# Altium project Project-C_CONTOLLER.PrjPCB
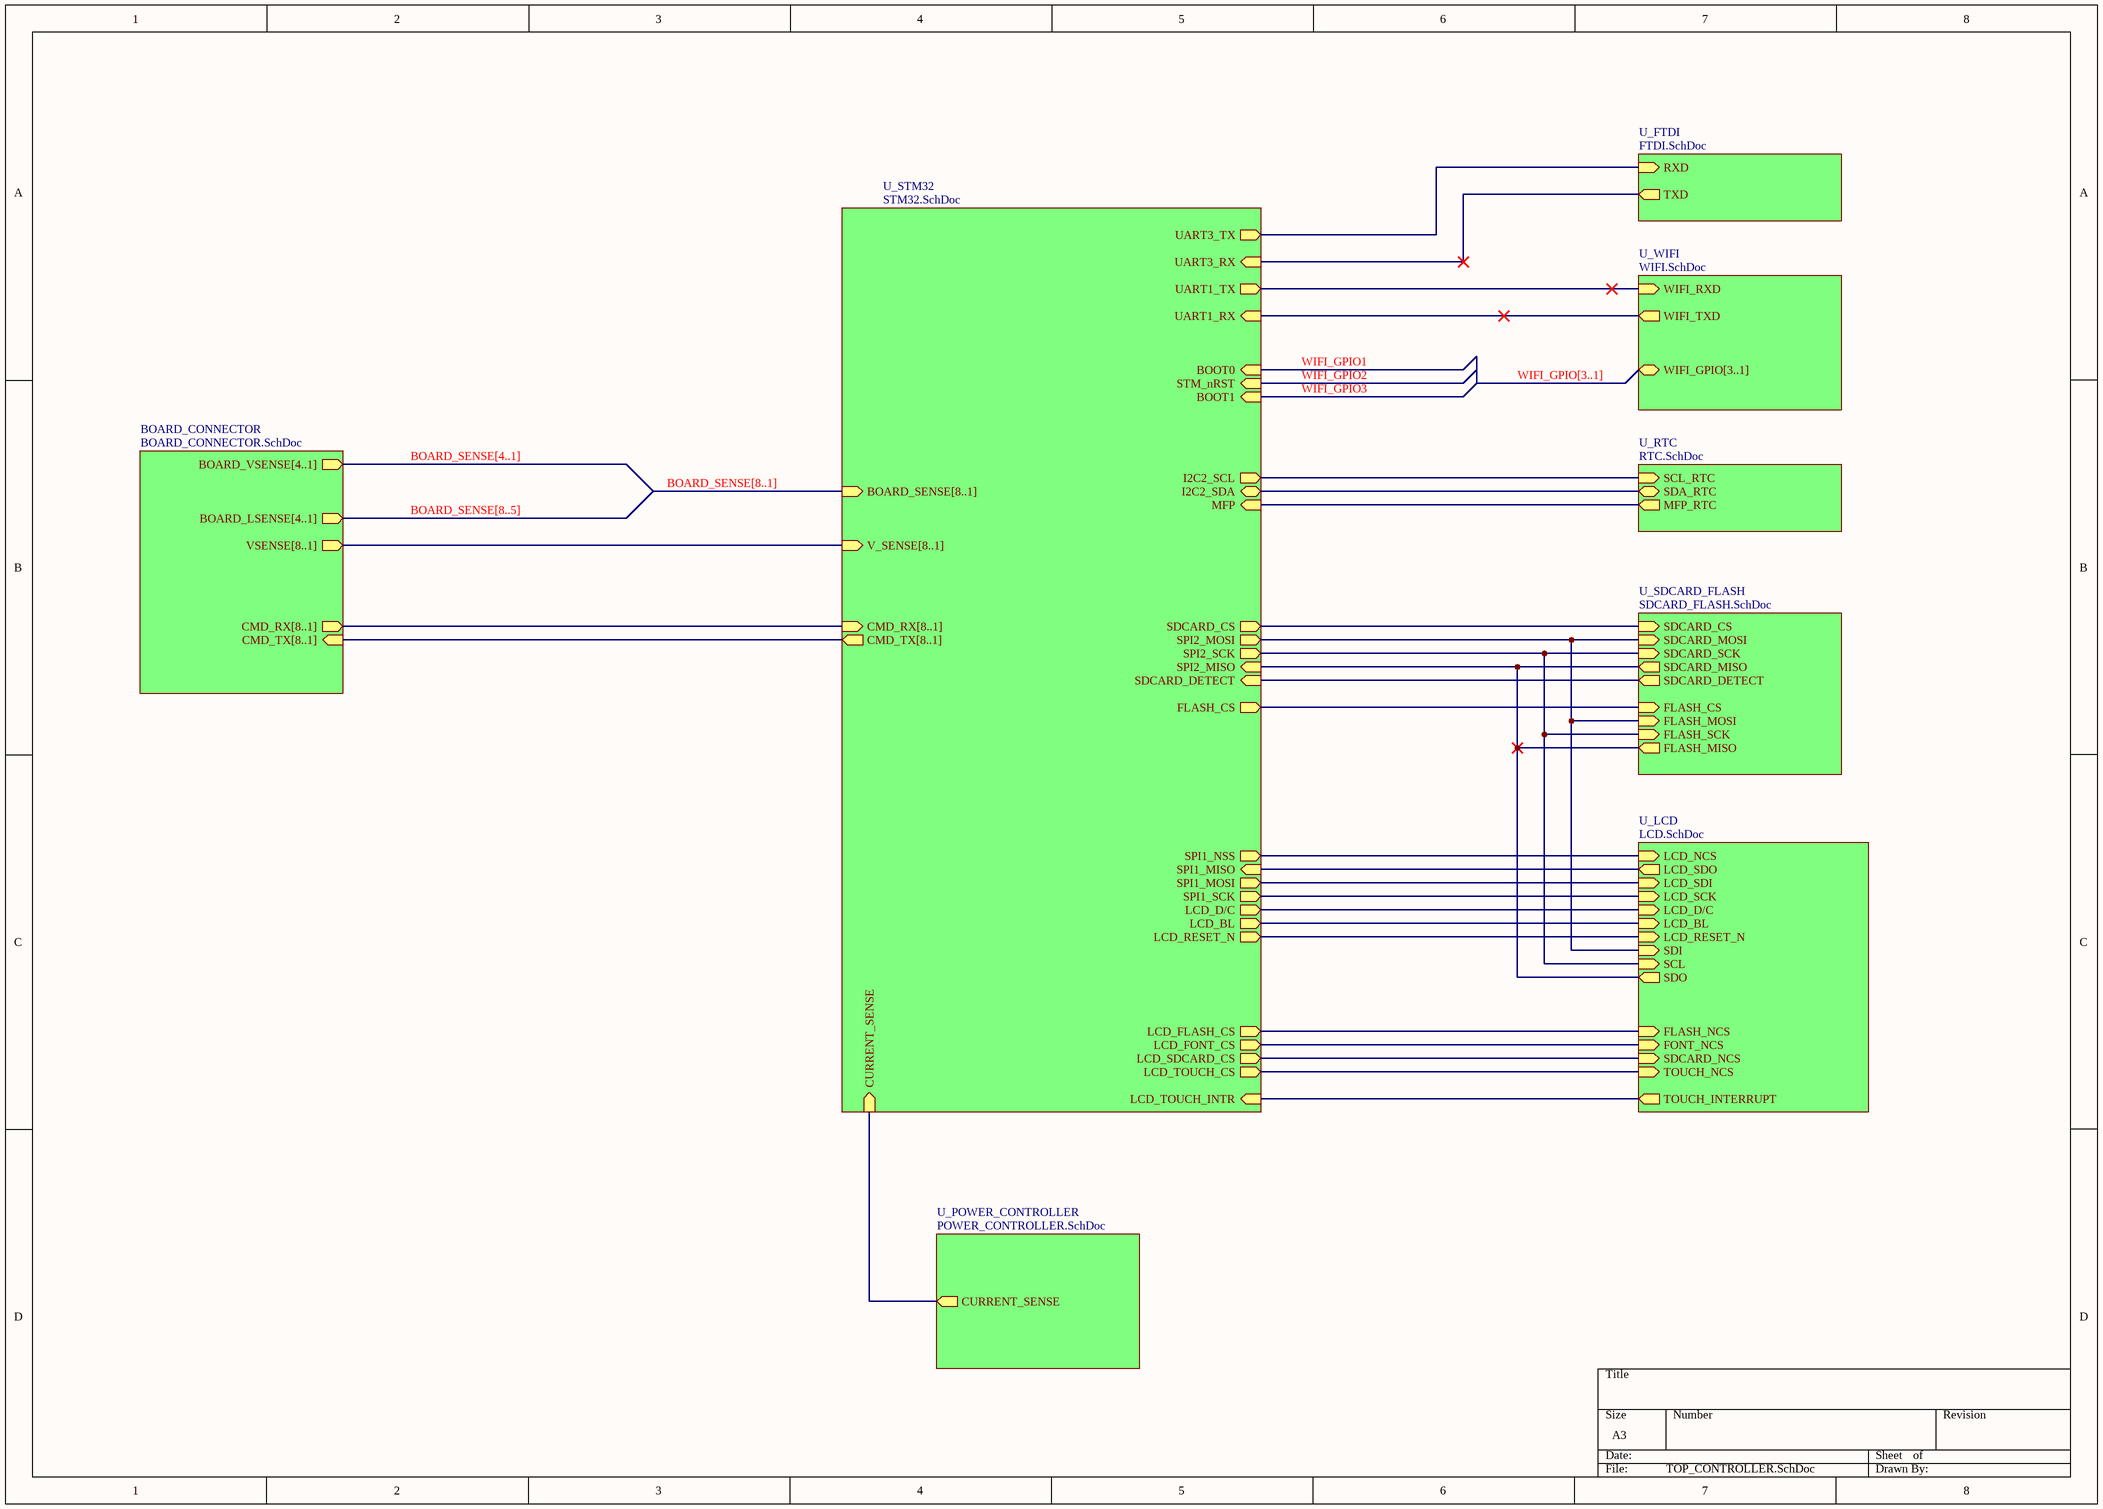
[diagram p0: TOP_CONTROLLER.SchDoc]
10 sheets, 191 parts. Net scope: hierarchical (ports join the sheet entries above them; power ports are global).
Board file: PCB4.PcbDoc
Sheets:
  TOP_CONTROLLER.SchDoc
    U_RTC = RTC.SchDoc
    U_FTDI = FTDI.SchDoc
    U_WIFI = WIFI.SchDoc
    U_STM32 = STM32.SchDoc
    U_SDCARD_FLASH = SDCARD_FLASH.SchDoc
    U_LCD = LCD.SchDoc
    BOARD_CONNECTOR = BOARD_CONNECTOR.SchDoc
      U_BOARD_CONNECTOR_1x_1 = BOARD_CONNECTOR_1x.SchDoc
      U_BOARD_CONNECTOR_1x_2 = BOARD_CONNECTOR_1x.SchDoc
      U_BOARD_CONNECTOR_1x_3 = BOARD_CONNECTOR_1x.SchDoc
      U_BOARD_CONNECTOR_1x_4 = BOARD_CONNECTOR_1x.SchDoc
    U_POWER_CONTROLLER = POWER_CONTROLLER.SchDoc

## Sheet TOP_CONTROLLER.SchDoc
size A3

### Sub-sheets
BOARD_CONNECTOR = BOARD_CONNECTOR.SchDoc: BOARD_VSENSE[4..1] (out), BOARD_LSENSE[4..1] (out), CMD_RX[8..1] (out), CMD_TX[8..1] (in), VSENSE[8..1] (out)
U_FTDI = FTDI.SchDoc: TXD (out), RXD (in)
U_LCD = LCD.SchDoc: TOUCH_INTERRUPT (out), SDO (out), SCL (in), SDI (in), FLASH_NCS (in), FONT_NCS (in), SDCARD_NCS (in), TOUCH_NCS (in), LCD_SCK (in), LCD_SDI (in), LCD_SDO (out), LCD_NCS (in), LCD_D/C (in), LCD_BL (in), LCD_RESET_N (in)
U_POWER_CONTROLLER = POWER_CONTROLLER.SchDoc: CURRENT_SENSE (out)
U_RTC = RTC.SchDoc: SCL_RTC (in), SDA_RTC (bidir), MFP_RTC (out)
U_SDCARD_FLASH = SDCARD_FLASH.SchDoc: SDCARD_CS (in), SDCARD_MOSI (in), SDCARD_SCK (in), SDCARD_MISO (out), FLASH_CS (in), FLASH_MISO (out), FLASH_SCK (in), FLASH_MOSI (in), SDCARD_DETECT (out)
U_STM32 = STM32.SchDoc: SPI1_NSS (out), SPI1_MOSI (out), SPI1_MISO (in), SPI1_SCK (out), SPI2_MOSI (out), SPI2_MISO (in), SPI2_SCK (out), I2C2_SCL (out), I2C2_SDA (bidir), UART1_TX (out), UART1_RX (in), UART3_RX (in), UART3_TX (out), STM_nRST (in), BOOT0 (in), BOOT1 (in), MFP (in), FLASH_CS (out), SDCARD_CS (out), LCD_D/C (out), LCD_TOUCH_INTR (in), LCD_TOUCH_CS (out), LCD_FONT_CS (out), LCD_FLASH_CS (out), LCD_SDCARD_CS (out), LCD_BL (out), LCD_RESET_N (out), CMD_RX[8..1] (in), CMD_TX[8..1] (out), BOARD_SENSE[8..1] (in), V_SENSE[8..1] (in), SDCARD_DETECT (in), CURRENT_SENSE (in)
U_WIFI = WIFI.SchDoc: WIFI_RXD (in), WIFI_TXD (out), WIFI_GPIO[3..1] (bidir)

### Nets
CURRENT_SENSE: sheet U_STM32/CURRENT_SENSE, sheet U_POWER_CONTROLLER/CURRENT_SENSE
FLASH_CS: sheet U_STM32/FLASH_CS, sheet U_SDCARD_FLASH/FLASH_CS
FLASH_MISO: sheet U_STM32/SPI2_MISO, sheet U_SDCARD_FLASH/SDCARD_MISO, sheet U_SDCARD_FLASH/FLASH_MISO, sheet U_LCD/SDO
FLASH_MOSI: sheet U_STM32/SPI2_MOSI, sheet U_SDCARD_FLASH/SDCARD_MOSI, sheet U_SDCARD_FLASH/FLASH_MOSI, sheet U_LCD/SDI
FLASH_NCS: sheet U_STM32/LCD_FLASH_CS, sheet U_LCD/FLASH_NCS
FLASH_SCK: sheet U_STM32/SPI2_SCK, sheet U_SDCARD_FLASH/SDCARD_SCK, sheet U_SDCARD_FLASH/FLASH_SCK, sheet U_LCD/SCL
FONT_NCS: sheet U_STM32/LCD_FONT_CS, sheet U_LCD/FONT_NCS
I2C2_SCL: sheet U_RTC/SCL_RTC, sheet U_STM32/I2C2_SCL
I2C2_SDA: sheet U_RTC/SDA_RTC, sheet U_STM32/I2C2_SDA
LCD_BL: sheet U_STM32/LCD_BL, sheet U_LCD/LCD_BL
LCD_D/C: sheet U_STM32/LCD_D/C, sheet U_LCD/LCD_D/C
LCD_NCS: sheet U_STM32/SPI1_NSS, sheet U_LCD/LCD_NCS
LCD_RESET_N: sheet U_STM32/LCD_RESET_N, sheet U_LCD/LCD_RESET_N
LCD_SCK: sheet U_STM32/SPI1_SCK, sheet U_LCD/LCD_SCK
LCD_SDCARD_CS: sheet U_STM32/LCD_SDCARD_CS, sheet U_LCD/SDCARD_NCS
LCD_SDI: sheet U_STM32/SPI1_MOSI, sheet U_LCD/LCD_SDI
LCD_SDO: sheet U_STM32/SPI1_MISO, sheet U_LCD/LCD_SDO
LCD_TOUCH_CS: sheet U_STM32/LCD_TOUCH_CS, sheet U_LCD/TOUCH_NCS
LCD_TOUCH_INTR: sheet U_STM32/LCD_TOUCH_INTR, sheet U_LCD/TOUCH_INTERRUPT
MFP: sheet U_RTC/MFP_RTC, sheet U_STM32/MFP
RXD: sheet U_FTDI/RXD, sheet U_STM32/UART3_TX
SDCARD_CS: sheet U_STM32/SDCARD_CS, sheet U_SDCARD_FLASH/SDCARD_CS
SDCARD_DETECT: sheet U_STM32/SDCARD_DETECT, sheet U_SDCARD_FLASH/SDCARD_DETECT
TXD: sheet U_FTDI/TXD, sheet U_STM32/UART3_RX
UART1_RX: sheet U_WIFI/WIFI_TXD, sheet U_STM32/UART1_RX
UART1_TX: sheet U_WIFI/WIFI_RXD, sheet U_STM32/UART1_TX

### Buses and harness runs
bus BOARD_SENSE[4..1] = sheet BOARD_CONNECTOR/BOARD_VSENSE[4..1]
bus BOARD_SENSE[8..1] = sheet U_STM32/BOARD_SENSE[8..1]
bus BOARD_SENSE[8..5] = sheet BOARD_CONNECTOR/BOARD_LSENSE[4..1]
bus sheet BOARD_CONNECTOR/CMD_RX[8..1] = sheet U_STM32/CMD_RX[8..1]
bus sheet BOARD_CONNECTOR/CMD_TX[8..1] = sheet U_STM32/CMD_TX[8..1]
bus sheet BOARD_CONNECTOR/VSENSE[8..1] = sheet U_STM32/V_SENSE[8..1]
bus WIFI_GPIO[3..1] = sheet U_WIFI/WIFI_GPIO[3..1]

## Sheet RTC.SchDoc
size B
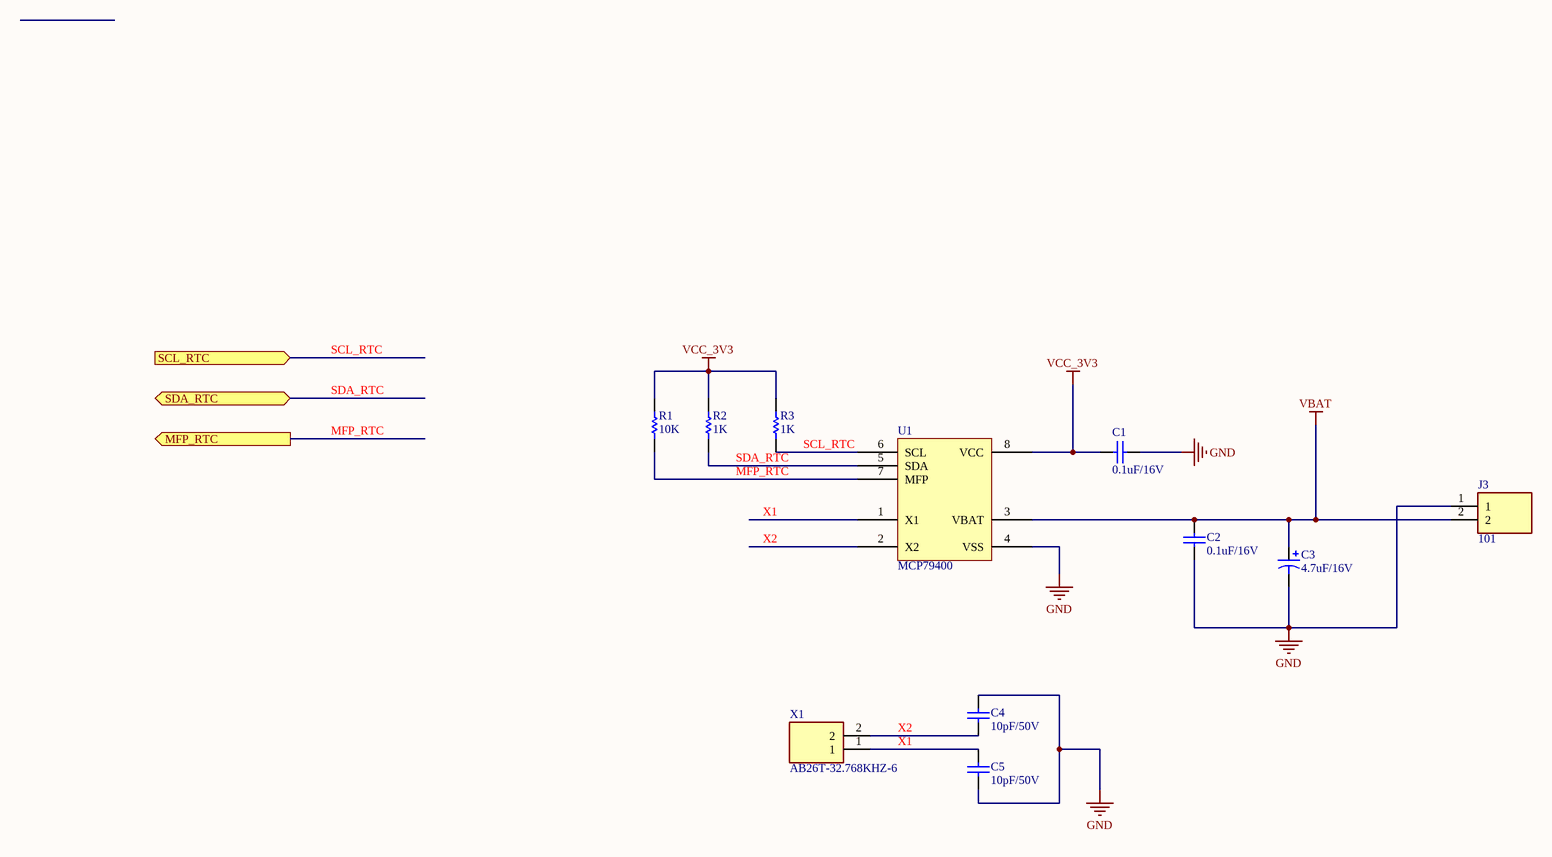
[diagram p1: RTC.SchDoc]

### Parts
C1  0.1uF/16V  [0603C]
C2  0.1uF/16V  [0603C]
C3  4.7uF/16V  [CASE-A]
C4  10pF/50V  [0603C]
C5  10pF/50V  [0603C]
J3  101  [101]
R1  10K  [0603R]
R2  1K  [0603R]
R3  1K  [0603R]
U1  MCP79400  [MCP79400-I/SN]
X1  AB26T-32.768KHZ-6  [AB26T32768KHZE]

### Ports
MFP_RTC (out), SCL_RTC (in), SDA_RTC (bidir)

### Nets
GND: C1.2 C2.2 C3.2 C4.1 C5.2 J3.1 U1.4(VSS)
VBAT: C2.1 C3.1 J3.2 U1.3(VBAT)
VCC_3V3: C1.1 R1.2 R2.2 R3.2 U1.8(VCC)
MFP_RTC: R1.1 U1.7(MFP) ; port MFP_RTC  [project net MFP]
SCL_RTC: R3.1 U1.6(SCL) ; port SCL_RTC  [project net I2C2_SCL]
SDA_RTC: R2.1 U1.5(SDA) ; port SDA_RTC  [project net I2C2_SDA]
X1: C5.1 U1.1(X1) X1.1
X2: C4.2 U1.2(X2) X1.2

### Library data of the parts
C1 = Cap: Multilayer Ceramic Capacitors MLCC - SMD/SMT 0603 16VDC 0.1uF 10% X7R AEC-Q2000; Mfr: Taiyo Yuden; Mfr Part No: EMK107B7104KAHT; Value: 0.1uF/16V; Package: 0603; Price: 0.101; Stockiest: MOUSER; Stockiest Part No: 963-EMK107B7104KAHT
C2 = 0805_CAP: Multilayer Ceramic Capacitors MLCC - SMD/SMT 0603 16VDC 0.1uF 10% X7R AEC-Q2000; Mfr Part No: EMK107B7104KAHT; Mfr: Taiyo Yuden; Price: 0.101; Stockiest: MOUSER; Stockiest Part No: 963-EMK107B7104KAHT; Value: 0.1uF/16V; Package: 0603
C3 = Cap Pol1: Tantalum Capacitors - Solid SMD 16V 4.7uF 1206; Mfr: KEMET; Mfr Part No: T495A475K016ATA2K0; Value: 4.7uF/16V; Package: 1206; Price: 1.83; Stockiest: MOUSER; Stockiest Part No: 80-T495A475K16ATA2K0
C4 C5 = Cap: Multilayer Ceramic Capacitors MLCC - SMD/SMT 50V 10pF 0603 C0G 5% AEC-Q200; Mfr: KEMET; Mfr Part No: C0603C100J5GACAUTO; Package: 0603; Price: 0.192; Stockiest: MOUSER; Stockiest Part No: 80-C0603C100J5GAUTO; Value: 10pF/50V
J3 = 101: Coin Cell Battery Holders 20mm coin cell HOLDER; Mfr Part No: 101; Price: 2.23; Stockiest: MOUSER; Stockiest Part No: 534-101; Value: -
R1 = Res1: Thick Film Resistors - SMD 0603 10Kohms 1% Anti-Sulfur AEC-Q200; Mfr: ROHM Semiconductor; Mfr Part No: SFR03EZPF1002; Value: 10K; Package: 0603; Price: 0.101; Stockiest: MOUSER; Stockiest Part No: 755-SFR03EZPF1002
R2 R3 = Res1: Resistor; Mfr: Vishay / Dale; Mfr Part No: CRCW06031K00FKEAC; Package: 0603; Price: 0.1; Stockiest: MOUSER; Stockiest Part No: 71-CRCW06031K00FKEAC; Value: 1K
U1 = MCP79400: Real Time Clock I2C GP RTCC 64B SRAM ID; Mfr: Microchip Technology; Mfr Part No: MCP79400-I/SN; Price: 0.827; Stockiest: MOUSER; Stockiest Part No: 579-MCP79400ISN
X1 = AB26T-32.768KHZ-6: Crystals 32.768KHz 6pF 32.768KHZ; Mfr: ABRACON; Mfr Part No: AB26T-32.768KHZ-6; Price: 0.252; Stockiest: MOUSER; Stockiest Part No: 815-AB26T-32.768K-6; Value: 32.768KHZ

## Sheet FTDI.SchDoc
size B
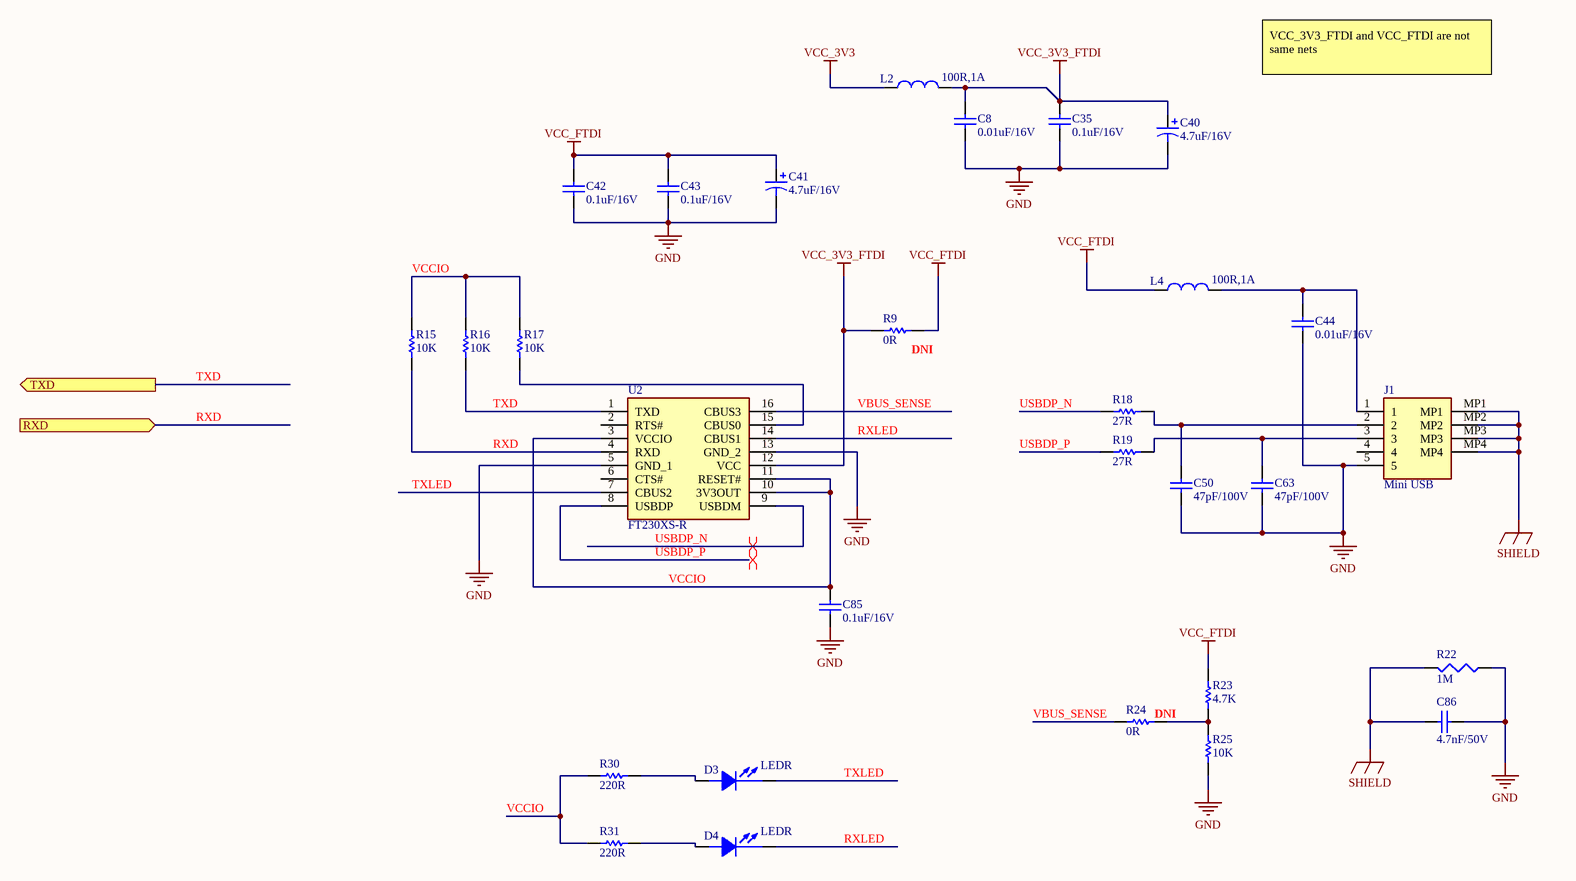
[diagram p2: FTDI.SchDoc]

### Parts
C8  0.01uF/16V  [0603C]
C35  0.1uF/16V  [0603C]
C40  4.7uF/16V  [CASE-A]
C41  4.7uF/16V  [CASE-A]
C42  0.1uF/16V  [0603C]
C43  0.1uF/16V  [0603C]
C44  0.01uF/16V  [0603C]
C50  47pF/100V  [0603C]
C63  47pF/100V  [0603C]
C85  0.1uF/16V  [0603C]
C86  4.7nF/50V  [0603C]
D3  LEDR  [LED_0603]
D4  LEDR  [LED_0603]
J1  Mini USB  [10033527-N3112LF]
L2  100R,1A  [0603L]
L4  100R,1A  [0603L]
R9  0R  [0603R]
R15  10K  [0603R]
R16  10K  [0603R]
R17  10K  [0603R]
R18  27R  [0603R]
R19  27R  [0603R]
R22  1M  [0805R]
R23  4.7K  [0603R]
R24  0R  [0603R]
R25  10K  [0603R]
R30  220R  [0603R]
R31  220R  [0603R]
U2  FT230XS-R  [FT230]

### Ports
RXD (in), TXD (out)

### Nets
GND: C8.2 C35.2 C40.2 C41.2 C42.1 C43.1 C44.2 C50.1 C63.1 C85.1 C86.1 J1.5 R22.2 R25.2 U2.5(GND_1) U2.13(GND_2)
SHIELD: C86.2 J1.MP1 J1.MP2 J1.MP3 J1.MP4 R22.1
VCC_3V3: L2.1
VCC_3V3_FTDI: C8.1 C35.1 C40.1 L2.2 R9.1 U2.12(VCC)
VCC_FTDI: C41.1 C42.2 C43.2 L4.1 R9.2 R23.2
RXD: R15.2 U2.4(RXD) ; port RXD
RXLED: D4.2(CATHODE) U2.14(CBUS1)
TXD: R16.2 U2.1(TXD) ; port TXD
TXLED: D3.2(CATHODE) U2.7(CBUS2)
USBDP_N: R18.2 U2.9(USBDM)
USBDP_P: R19.2 U2.8(USBDP)
VBUS_SENSE: R24.1 U2.16(CBUS3)
VCCIO: C85.2 R15.1 R16.1 R17.1 R30.2 R31.2 U2.3(VCCIO) U2.10(3V3OUT) U2.11(RESET#)
NetC44_1: C44.1 J1.1 L4.2
NetC50_2: C50.2 J1.2 R18.1
NetC63_2: C63.2 J1.3 R19.1
NetD3_1: D3.1(ANODE) R30.1
NetD4_1: D4.1(ANODE) R31.1
NetR17_2: R17.2 U2.15(CBUS0)
NetR23_1: R23.1 R24.2 R25.1

Not connected (* = marked no-connect by the designer): J1 4; U2 2(RTS#) 6(CTS#)

### Layout directives
differential pair: USBDP_N, USBDP_P

### Notes on the sheet
- VCC_3V3_FTDI and VCC_FTDI are not same nets
- (near R9) DNI
- (near R24) DNI

### Library data of the parts
C8 C44 = Cap: Multilayer Ceramic Capacitors MLCC - SMD/SMT 16V 0.01uF X7R 0603 10% AEC-Q200; Mfr: KEMET; Mfr Part No: C0603C103K4RECAUTO; Package: 0603; Price: 0.151; Stockiest: MOUSER; Stockiest Part No: 80-C0603C103K4RECAUT; Value: 0.01uF/16V
C35 = Cap: Multilayer Ceramic Capacitors MLCC - SMD/SMT 0603 16VDC 0.1uF 10% X7R AEC-Q200; Mfr: Taiyo Yuden; Mfr Part No: EMK107B7104KAHT; Package: 0603; Price: 0.101; Stockiest: MOUSER; Stockiest Part No: 963-EMK107B7104KAHT; Value: 0.1uF/16V
C40 C41 = Cap Pol1: as C3 on sheet RTC; Value: 4.7uF/16V; Package: 1206; Price: 1.83; Stockiest: MOUSER; Stockiest Part No: 80-T495A475K16ATA2K0
C42 C43 C85 = Cap: as C1 on sheet RTC; Value: 0.1uF/16V; Package: 0603; Price: 0.101; Stockiest: MOUSER; Stockiest Part No: 963-EMK107B7104KAHT
C50 C63 = Cap: Multilayer Ceramic Capacitors MLCC - SMD/SMT 100V 47pF 0603 X8R 20% AEC-Q200; Mfr: KEMET; Mfr Part No: C0603C470M1HACAUTO; Value: 47pF/100V; Package: 0603; Price: 0.121; Stockiest: MOUSER; Stockiest Part No: 80-C0603C470M1HAUTO
C86 = 0805_CAP: Multilayer Ceramic Capacitors MLCC - SMD/SMT 50V 4700pF X7R 0603 10% AEC-Q200; Mfr Part No: C0603C472K5RACAUTO7411; Mfr: KEMET; Price: 0.221; Stockiest: MOUSER; Stockiest Part No: 80-C0603C472K5RAUTLR; Value: 4.7nF/50V; Package: 0603
D3 D4 = LED: Standard LEDs - SMD Red 631nm 14mcd 5mA; Mfr Part No: LTST-C193KRKT-5A; Mfr: Lite On; Package: 0603; Price: 0.28; Stockiest Part No: 859-LTSTC193KRKT5A; Value: RED; Stockiest: MOUSER
J1 = 10033527-N3112LF: USB Connectors M-USB 1X1 B/REC R/A SMT; Mfr: TE Connectivity; Mfr Part No: 1734035-2; Price: 1.59; Stockiest: MOUSER; Stockiest Part No: 571-1734035-2
L2 L4 = 0805_IND: Ferrite Beads 100ohms 1A 60mOhms 0603 Ferrite Chip; Mfr: TDK; Mfr Part No: MPZ1608D101BTA00; Value: 100R/1A; Package: 0603; Price: 0.10; Stockiest: MOUSER; Stockiest Part No: 810-MPZ1608D101BTA00
R9 R24 = Res1: Thick Film Resistors - SMD 1/10Watt 0ohms Commercial Use; Mfr: Vishay / Dale; Mfr Part No: CRCW06030000Z0EAC; Value: 0R; Package: 0603; Price: 0.101; Stockiest: MOUSER; Stockiest Part No: 71-CRCW06030000Z0EAC
R15-R17 R25 = Res1: as R1 on sheet RTC; Value: 10K; Package: 0603; Price: 0.101; Stockiest: MOUSER; Stockiest Part No: 755-SFR03EZPF1002
R18 R19 = Res1: Thick Film Resistors - SMD 0603 0.25W 1% 27ohm AEC-Q200; Mfr: Panasonic; Mfr Part No: ERJ-UP3F27R0V; Value: 27R; Package: 0603; Price: 0.262; Stockiest: MOUSER; Stockiest Part No: 667-ERJ-UP3F27R0V
R22 = 0805_RES: Thick Film Resistors - SMD 0603 0.25W 1% 1Mohm AEC-Q200; Mfr Part No: ERJ-UP3F1004V; Mfr: Panasonic; Price: 0.262; Stockiest: MOUSER; Stockiest Part No: 667-ERJ-UP3F1004V; Value: 1M; Package: 0603
R23 = Res1: Thick Film Resistors - SMD 1/10Watt 4.7Kohms 5% Commercial Use; Mfr: Vishay / Dale; Mfr Part No: CRCW06034K70JNEAC; Package: 0603; Price: 0.101; Stockiest: MOUSER; Stockiest Part No: 71-CRCW06034K70JNEAC; Value: 4.7K
R30 R31 = Res1: Thick Film Resistors - SMD 1/10Watt 220ohms 5% Commercial Use; Mfr: Vishay / Dale; Mfr Part No: CRCW0603220RJNEAC; Package: 0603; Price: 0.101; Stockiest: MOUSER; Stockiest Part No: 71-CRCW0603220RJNEAC; Value: 220R
U2 = FT230: USB Interface IC USB to Basic Serial UART IC SSOP-16; Mfr: FTDI; Mfr Part No: FT230XS-R; Price: 2.06; Stockiest: MOUSER; Stockiest Part No: 895-FT230XS-R

## Sheet WIFI.SchDoc
size B
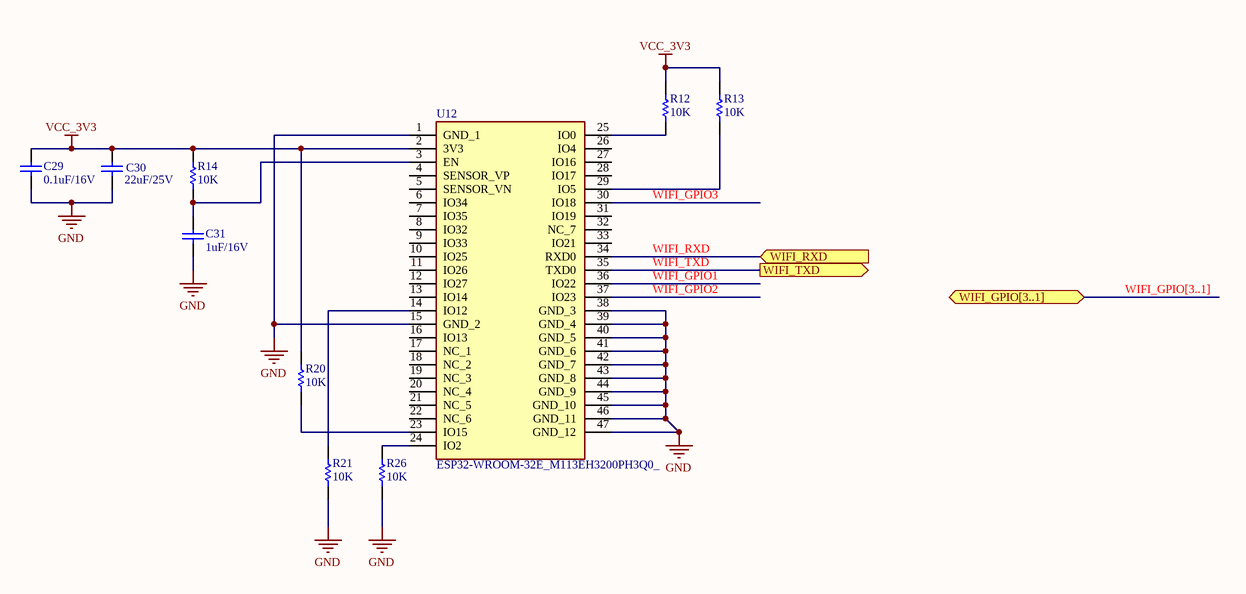
[diagram p3: WIFI.SchDoc]

### Parts
C29  0.1uF/16V  [0603C]
C30  22uF/25V  [1210C]
C31  1uF/16V  [0603C]
R12  10K  [0603R]
R13  10K  [0603R]
R14  10K  [0603R]
R20  10K  [0603R]
R21  10K  [0603R]
R26  10K  [0603R]
U12  ESP32-WROOM-32E_M113EH3200PH3Q0_  [ESP32WROOM32EM113EH3200PH3Q0]

### Ports
WIFI_GPIO[3..1] (bidir), WIFI_RXD (in), WIFI_TXD (out)

### Nets
GND: C29.2 C30.1 C31.2 R21.2 R26.2 U12.1(GND_1) U12.15(GND_2) U12.38(GND_3) U12.39(GND_4) U12.40(GND_5) U12.41(GND_6) U12.42(GND_7) U12.43(GND_8) U12.44(GND_9) U12.45(GND_10) U12.46(GND_11) U12.47(GND_12)
VCC_3V3: C29.1 C30.2 R12.1 R13.1 R14.1 R20.1 U12.2(3V3)
WIFI_GPIO1: U12.36(IO22)  [project net BOOT0]
WIFI_GPIO2: U12.37(IO23)  [project net STM_nRST]
WIFI_GPIO3: U12.30(IO18)  [project net BOOT1]
WIFI_RXD: U12.34(RXD0) ; port WIFI_RXD  [project net UART1_TX]
WIFI_TXD: U12.35(TXD0) ; port WIFI_TXD  [project net UART1_RX]
NetC31_1: C31.1 R14.2 U12.3(EN)
NetR12_2: R12.2 U12.25(IO0)
NetR13_2: R13.2 U12.29(IO5)
NetR20_2: R20.2 U12.23(IO15)
NetR21_1: R21.1 U12.14(IO12)
NetR26_1: R26.1 U12.24(IO2)

Not connected (* = marked no-connect by the designer): U12 4(SENSOR_VP) 5(SENSOR_VN) 6(IO34) 7(IO35) 8(IO32) 9(IO33) 10(IO25) 11(IO26) 12(IO27) 13(IO14) 16(IO13) 17(NC_1) 18(NC_2) 19(NC_3) 20(NC_4) 21(NC_5) 22(NC_6) 26(IO4) 27(IO16) 28(IO17) 31(IO19) 32(NC_7) 33(IO21)

### Buses and harness runs
bus WIFI_GPIO[3..1] = port WIFI_GPIO[3..1]

### Library data of the parts
C29 = Cap: as C1 on sheet RTC; Value: 0.1uF/16V; Package: 0603; Price: 0.101; Stockiest: MOUSER; Stockiest Part No: 963-EMK107B7104KAHT
C30 = Cap: Multilayer Ceramic Capacitors MLCC - SMD/SMT 1210 25VDC 22uF 20% X7R AEC-Q200; Mfr: Taiyo Yuden; Mfr Part No: TMK325B7226MMHP; Package: 1210; Price: 0.807; Stockiest: MOUSER; Stockiest Part No: 963-TMK325B7226MMHP; Value: 22uF/25V
C31 = Cap: Multilayer Ceramic Capacitors MLCC - SMD/SMT 16volts 1uF X7R 10%; Mfr: KEMET; Mfr Part No: C0603C105K4RAC7411; Value: 1uF/16V; Package: 0603; Price: 0.101; Stockiest: MOUSER; Stockiest Part No: 80-C0603C105K4RLR
R12-R14 R20 R21 R26 = Res1: as R1 on sheet RTC; Value: 10K; Package: 0603; Price: 0.101; Stockiest: MOUSER; Stockiest Part No: 755-SFR03EZPF1002
U12 = ESP32-WROOM-32E_M113EH3200PH3Q0_: Integrated Circuit; Mfr: Espressif Systems; Mfr Part No: ESP32-WROOM-32E(M113EH3200PH3Q0); Price: 2.62; Stockiest: MOUSER; Stockiest Part No: 356-ESP32WRM32E132PH

## Sheet STM32.SchDoc
size 508 x 281 mm
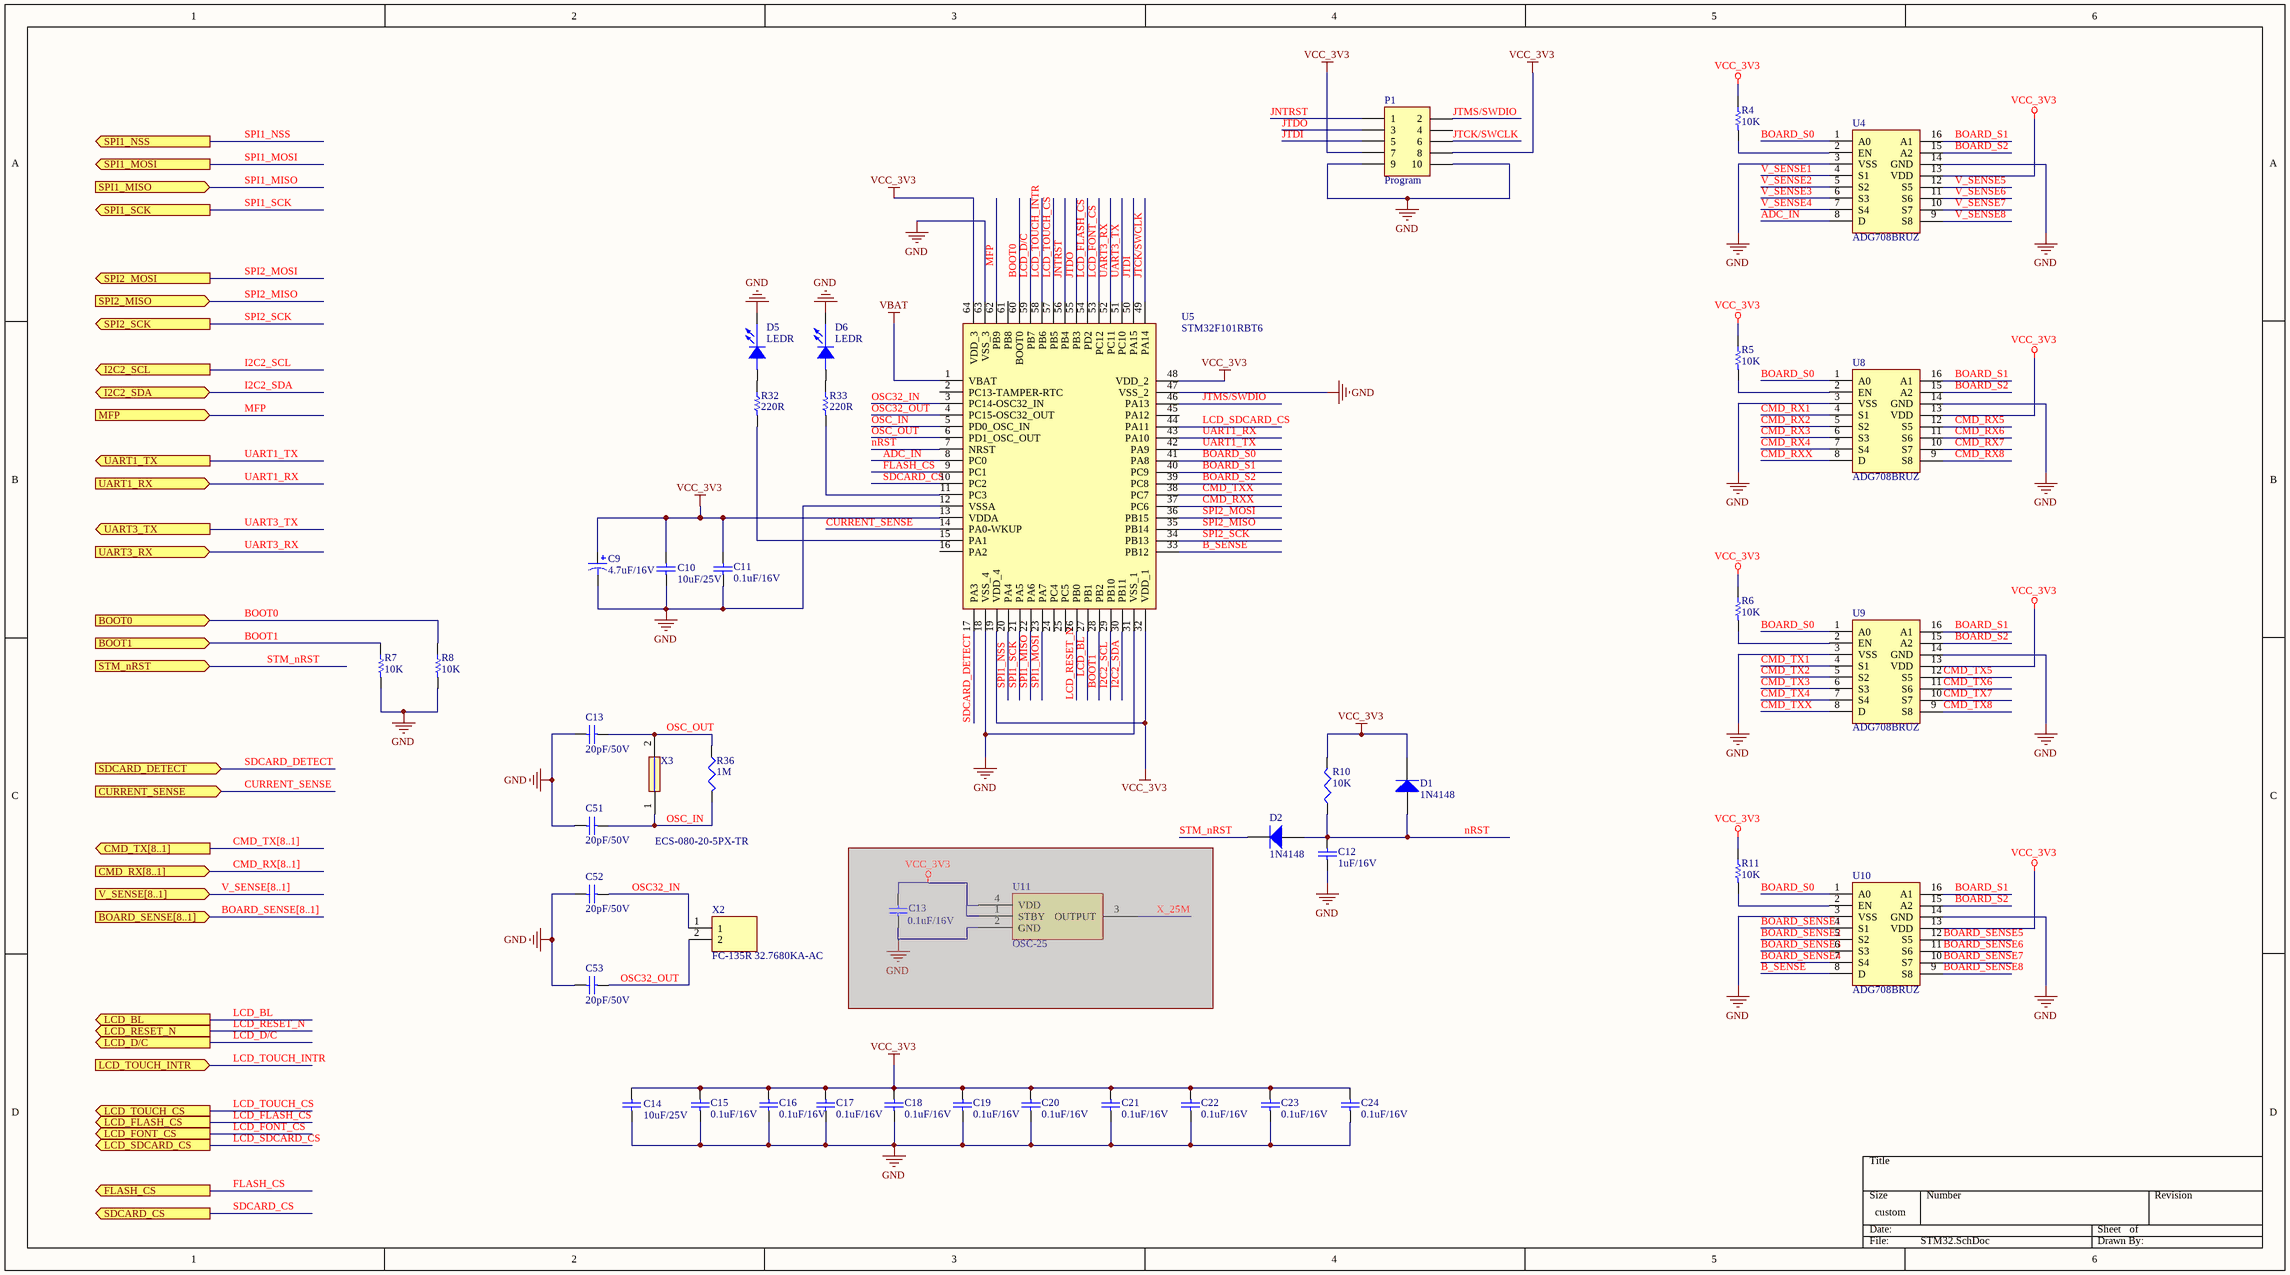
[diagram p4: STM32.SchDoc]

### Parts
(Parts that share a designator on the sheet are numbered #1, #2 ... from top to bottom, then left to right.)
C9  4.7uF/16V  [CASE-A]
C10  10uF/25V  [0805C]
C11  0.1uF/16V  [0603C]
C12  1uF/16V  [0603C]
C13#1  20pF/50V  [0603C]
C13#2  0.1uF/16V  [0603C]  (masked out: inside a compile mask, not in the netlist)
C14  10uF/25V  [0805C]
C15  0.1uF/16V  [0603C]
C16  0.1uF/16V  [0603C]
C17  0.1uF/16V  [0603C]
C18  0.1uF/16V  [0603C]
C19  0.1uF/16V  [0603C]
C20  0.1uF/16V  [0603C]
C21  0.1uF/16V  [0603C]
C22  0.1uF/16V  [0603C]
C23  0.1uF/16V  [0603C]
C24  0.1uF/16V  [0603C]
C51  20pF/50V  [0603C]
C52  20pF/50V  [0603C]
C53  20pF/50V  [0603C]
D1  1N4148  [1N4148W-13-F]
D2  1N4148  [1N4148W-13-F]
D5  LEDR  [LED_0603]
D6  LEDR  [LED_0603]
P1  Program  [HDR2X5]
R4  10K  [0603R]
R5  10K  [0603R]
R6  10K  [0603R]
R7  10K  [0603R]
R8  10K  [0603R]
R10  10K  [0603R]
R11  10K  [0603R]
R32  220R  [0603R]
R33  220R  [0603R]
R36  1M  [0805R]
U4  ADG708BRUZ  [ADG708BRUZ]
U5  STM32F101RBT6  [STM32F101RBT6]
U8  ADG708BRUZ  [ADG708BRUZ]
U9  ADG708BRUZ  [ADG708BRUZ]
U10  ADG708BRUZ  [ADG708BRUZ]
U11#1  OSC-25  [ASE-25.000MHZ-LC-T]  (masked out: inside a compile mask, not in the netlist)
X2  FC-135R 32.7680KA-AC  [FC-135R 32.7680KA-AC]
X3  ECS-080-20-5PX-TR  [ECS-080-20-5PX-TR]

### Ports
BOARD_SENSE[8..1] (in), BOOT0 (in), BOOT1 (in), CMD_RX[8..1] (in), CMD_TX[8..1] (out), CURRENT_SENSE (in), FLASH_CS (out), I2C2_SCL (out), I2C2_SDA (bidir), LCD_BL (out), LCD_D/C (out), LCD_FLASH_CS (out), LCD_FONT_CS (out), LCD_RESET_N (out), LCD_SDCARD_CS (out), LCD_TOUCH_CS (out), LCD_TOUCH_INTR (in), MFP (in), SDCARD_CS (out), SDCARD_DETECT (in), SPI1_MISO (in), SPI1_MOSI (out), SPI1_NSS (out), SPI1_SCK (out), SPI2_MISO (in), SPI2_MOSI (out), SPI2_SCK (out), STM_nRST (in), UART1_RX (in), UART1_TX (out), UART3_RX (in), UART3_TX (out), V_SENSE[8..1] (in)

### Nets
GND: C9.2 C10.1 C11.2 C12.2 C13#1.2 C14.1 C15.2 C16.2 C17.2 C18.2 C19.2 C20.2 C21.2 C22.2 C23.2 C24.2 C51.2 C52.2 C53.2 D5.2(CATHODE) D6.2(CATHODE) P1.9 P1.10 R7.2 R8.2 U4.3(VSS) U4.14(GND) U5.12(VSSA) U5.18(VSS_4) U5.31(VSS_1) U5.47(VSS_2) U5.63(VSS_3) U8.3(VSS) U8.14(GND) U9.3(VSS) U9.14(GND) U10.3(VSS) U10.14(GND)
VBAT: U5.1(VBAT)
VCC_3V3: C9.1 C10.2 C11.1 C14.2 C15.1 C16.1 C17.1 C18.1 C19.1 C20.1 C21.1 C22.1 C23.1 C24.1 D1.2(K) P1.7 P1.8 R4.1 R5.1 R6.1 R10.2 R11.1 U4.13(VDD) U5.13(VDDA) U5.19(VDD_4) U5.32(VDD_1) U5.48(VDD_2) U5.64(VDD_3) U8.13(VDD) U9.13(VDD) U10.13(VDD)
ADC_IN: U4.8(D) U5.8(PC0)
B_SENSE: U5.33(PB12) U10.8(D)
BOARD_S0: U4.1(A0) U5.41(PA8) U8.1(A0) U9.1(A0) U10.1(A0)
BOARD_S1: U4.16(A1) U5.40(PC9) U8.16(A1) U9.16(A1) U10.16(A1)
BOARD_S2: U4.15(A2) U5.39(PC8) U8.15(A2) U9.15(A2) U10.15(A2)
BOARD_SENSE1: U10.4(S1)
BOARD_SENSE2: U10.5(S2)
BOARD_SENSE3: U10.6(S3)
BOARD_SENSE4: U10.7(S4)
BOARD_SENSE5: U10.12(S5)  [project net BOARD_LSENSE]
BOARD_SENSE6: U10.11(S6)  [project net BOARD_LSENSE]
BOARD_SENSE7: U10.10(S7)  [project net BOARD_LSENSE]
BOARD_SENSE8: U10.9(S8)  [project net BOARD_LSENSE]
BOOT0: R8.1 U5.60(BOOT0) ; port BOOT0
BOOT1: R7.1 U5.28(PB2) ; port BOOT1
CMD_RX1: U8.4(S1)
CMD_RX2: U8.5(S2)
CMD_RX3: U8.6(S3)  [project net CMD_RX1]
CMD_RX4: U8.7(S4)  [project net CMD_RX2]
CMD_RX5: U8.12(S5)  [project net CMD_RX1]
CMD_RX6: U8.11(S6)  [project net CMD_RX2]
CMD_RX7: U8.10(S7)  [project net CMD_RX1]
CMD_RX8: U8.9(S8)  [project net CMD_RX2]
CMD_RXX: U5.37(PC6) U8.8(D)
CMD_TX1: U9.4(S1)
CMD_TX2: U9.5(S2)
CMD_TX3: U9.6(S3)  [project net CMD_TX1]
CMD_TX4: U9.7(S4)  [project net CMD_TX2]
CMD_TX5: U9.12(S5)  [project net CMD_TX1]
CMD_TX6: U9.11(S6)  [project net CMD_TX2]
CMD_TX7: U9.10(S7)  [project net CMD_TX1]
CMD_TX8: U9.9(S8)  [project net CMD_TX2]
CMD_TXX: U5.38(PC7) U9.8(D)
CURRENT_SENSE: U5.14(PA0-WKUP) ; port CURRENT_SENSE
FLASH_CS: U5.9(PC1) ; port FLASH_CS
I2C2_SCL: U5.29(PB10) ; port I2C2_SCL
I2C2_SDA: U5.30(PB11) ; port I2C2_SDA
JNTRST: P1.1 U5.56(PB4)
JTCK/SWCLK: P1.6 U5.49(PA14)
JTDI: P1.5 U5.50(PA15)
JTDO: P1.3 U5.55(PB3)
JTMS/SWDIO: P1.2 U5.46(PA13)
LCD_BL: U5.27(PB1) ; port LCD_BL
LCD_D/C: U5.59(PB7) ; port LCD_D/C
LCD_FLASH_CS: U5.54(PD2) ; port LCD_FLASH_CS  [project net FLASH_NCS]
LCD_FONT_CS: U5.53(PC12) ; port LCD_FONT_CS  [project net FONT_NCS]
LCD_RESET_N: U5.26(PB0) ; port LCD_RESET_N
LCD_SDCARD_CS: U5.44(PA11) ; port LCD_SDCARD_CS
LCD_TOUCH_CS: U5.57(PB5) ; port LCD_TOUCH_CS
LCD_TOUCH_INTR: U5.58(PB6) ; port LCD_TOUCH_INTR
MFP: U5.62(PB9) ; port MFP
nRST: C12.1 D1.1(A) D2.1(A) R10.1 U5.7(NRST)
OSC32_IN: C52.1 U5.3(PC14-OSC32_IN) X2.1
OSC32_OUT: C53.1 U5.4(PC15-OSC32_OUT) X2.2
OSC_IN: C51.1 R36.1 U5.5(PD0_OSC_IN) X3.1
OSC_OUT: C13#1.1 R36.2 U5.6(PD1_OSC_OUT) X3.2
SDCARD_CS: U5.10(PC2) ; port SDCARD_CS
SDCARD_DETECT: U5.17(PA3) ; port SDCARD_DETECT
SPI1_MISO: U5.22(PA6) ; port SPI1_MISO  [project net LCD_SDO]
SPI1_MOSI: U5.23(PA7) ; port SPI1_MOSI  [project net LCD_SDI]
SPI1_NSS: U5.20(PA4) ; port SPI1_NSS  [project net LCD_NCS]
SPI1_SCK: U5.21(PA5) ; port SPI1_SCK  [project net LCD_SCK]
SPI2_MISO: U5.35(PB14) ; port SPI2_MISO  [project net FLASH_MISO]
SPI2_MOSI: U5.36(PB15) ; port SPI2_MOSI  [project net FLASH_MOSI]
SPI2_SCK: U5.34(PB13) ; port SPI2_SCK  [project net FLASH_SCK]
STM_nRST: D2.2(K) ; port STM_nRST
UART1_RX: U5.43(PA10) ; port UART1_RX
UART1_TX: U5.42(PA9) ; port UART1_TX
UART3_RX: U5.52(PC11) ; port UART3_RX  [project net TXD]
UART3_TX: U5.51(PC10) ; port UART3_TX  [project net RXD]
V_SENSE1: U4.4(S1)
V_SENSE2: U4.5(S2)
V_SENSE3: U4.6(S3)  [project net V_SENSE1]
V_SENSE4: U4.7(S4)  [project net V_SENSE2]
V_SENSE5: U4.12(S5)  [project net V_SENSE1]
V_SENSE6: U4.11(S6)  [project net V_SENSE2]
V_SENSE7: U4.10(S7)  [project net V_SENSE1]
V_SENSE8: U4.9(S8)  [project net V_SENSE2]
NetD5_1: D5.1(ANODE) R32.1
NetD6_1: D6.1(ANODE) R33.1
NetR4_2: R4.2 U4.2(EN)
NetR5_2: R5.2 U8.2(EN)
NetR6_2: R6.2 U9.2(EN)
NetR11_2: R11.2 U10.2(EN)
NetR32_2: R32.2 U5.15(PA1)
NetR33_2: R33.2 U5.11(PC3)

Not connected (* = marked no-connect by the designer): P1 4; U5 2(PC13-TAMPER-RTC) 16(PA2) 24(PC4) 25(PC5) 45(PA12) 61(PB8)

### Buses and harness runs
bus BOARD_SENSE[8..1] = port BOARD_SENSE[8..1]
bus CMD_RX[8..1] = port CMD_RX[8..1]
bus CMD_TX[8..1] = port CMD_TX[8..1]
bus V_SENSE[8..1] = port V_SENSE[8..1]

### Library data of the parts
C9 = Cap Pol1: as C3 on sheet RTC; Value: 4.7uF/16V; Package: 1206; Price: 1.83; Stockiest: MOUSER; Stockiest Part No: 80-T495A475K16ATA2K0
C10 C14 = Cap: Multilayer Ceramic Capacitors MLCC - SMD/SMT 0805 25VDC 10uF 20% X5R; Mfr: Taiyo Yuden; Mfr Part No: TMK212BBJ106MG-T; Package: 0805; Price: 0.232; Stockiest: MOUSER; Stockiest Part No: 963-TMK212BBJ106MG-T; Value: 10uF/25V
C11 C15-C24 = Cap: as C1 on sheet RTC; Value: 0.1uF/16V; Package: 0603; Price: 0.101; Stockiest: MOUSER; Stockiest Part No: 963-EMK107B7104KAHT
C12 = Cap: as C31 on sheet WIFI; Value: 1uF/16V; Package: 0603; Price: 0.101; Stockiest: MOUSER; Stockiest Part No: 80-C0603C105K4RLR
C13#1 C51-C53 = Cap: Multilayer Ceramic Capacitors MLCC - SMD/SMT 50V 20pF 0603 C0G 5% AEC-Q200; Mfr Part No: C0603C200J5GACAUTO; Mfr: KEMET; Value: 20pF/50V; Stockiest: MOUSER; Stockiest Part No: 80-C0603C200J5GAUTO; Package: 0603; Price: 0.322
C13#2 = Cap: Multilayer Ceramic Capacitors MLCC - SMD/SMT 0603 16VDC 0.1uF 10% X7R AEC-Q2000; Mfr Part No: EMK107B7104KAHT; Mfr: Taiyo Yuden; Value: 0.1uF/16V; Stockiest: MOUSER; Stockiest Part No: 963-EMK107B7104KAHT; Package: 0603; Price: 0.101
D1 D2 = Diode: Diodes - General Purpose, Power, Switching 400mW 100Vrrm 4ns; Mfr: Diodes Incorporated; Value: 100V; Stockiest: MOUSER; Stockiest Part No: 621-1N4148W-13-F; Mfr Part No: 1N4148W-13-F; Package: SOD-123-2; Price: 0.171
D5 D6 = LED: Standard LEDs - SMD Red 631nm 14mcd 5mA; Mfr: Lite On; Mfr Part No: LTST-C193KRKT-5A; Package: 0603; Price: 0.28; Stockiest: MOUSER; Stockiest Part No: 859-LTSTC193KRKT5A; Value: RED
P1 = Header 5X2: Header, 5-Pin, Dual row; LatestRevisionDate: 17-Jul-2002; LatestRevisionNote: Re-released for DXP Platform.; Publisher: Altium Limited
R4-R8 R11 = Res1: as R1 on sheet RTC; Value: 10K; Package: 0603; Price: 0.101; Stockiest: MOUSER; Stockiest Part No: 755-SFR03EZPF1002
R10 = 0402_RES: Thick Film Resistors - SMD 0603 10Kohms 1% Anti-Sulfur AEC-Q200; Mfr Part No: SFR03EZPF1002; Mfr: ROHM Semiconductor; Package: 0603; Price: 0.101; Stockiest Part No: 755-SFR03EZPF1002; Value: 10K; Stockiest: MOUSER
R32 R33 = Res1: as R30 on sheet FTDI; Package: 0603; Price: 0.101; Stockiest: MOUSER; Stockiest Part No: 71-CRCW0603220RJNEAC; Value: 220R
R36 = 0805_RES: as R22 on sheet FTDI; Price: 0.262; Stockiest: MOUSER; Stockiest Part No: 667-ERJ-UP3F1004V; Value: 1M; Package: 0603
U4 U8-U10 = ADG708BRUZ: Multiplexer Switch ICs 8-CHANNEL MUX; Mfr: Analog Devices; Mfr Part No: ADG708BRUZ; Price: 3.68; Stockiest: MOUSER; Stockiest Part No: 584-ADG708BRUZ
U5 = STM32F101RBT6: ARM Microcontrollers - MCU 32BIT Cortex M3 128K 16KB RAM 1X12 ADC; Mfr: STMicroelectronics; Mfr Part No: STM32F101RBT6; Price: 5.12; Stockiest: MOUSER; Stockiest Part No: 511-STM32F101RBT6
U11#1 = CRYSTAL: Standard Clock Oscillators 25.0 MHZ 3.3V 50PPM SMD 32; Mfr: ABRACON; Value: 25MHZ; Mfr Part No: ASE-25.000MHZ-LC-T; Price: 1.42; Stockiest: MOUSER; Stockiest Part No: 815-ASE25.000MHZLCT
X2 = FC-135R_32.7680KA-A0: Crystals SMD XTL KHZ +/-20PPM,-40 85C 9.0PF BULK; Mfr: Epson Timing; Value: 32.768K; Mfr Part No: FC-135R 32.7680KA-AC; Price: 0.584; Stockiest: MOUSER; Stockiest Part No: 732-5R32.7680KA-AC
X3 = ABLS-12.000MHZ-B4-T: Crystals 8MHz 20pF -10C +70C; Mfr: ECS; Mfr Part No: ECS-080-20-5PX-TR; Price: 0.273; Stockiest: MOUSER; Stockiest Part No: 520-ECS-080-20-5PX-T; Value: 8Mhz

## Sheet SDCARD_FLASH.SchDoc
size B
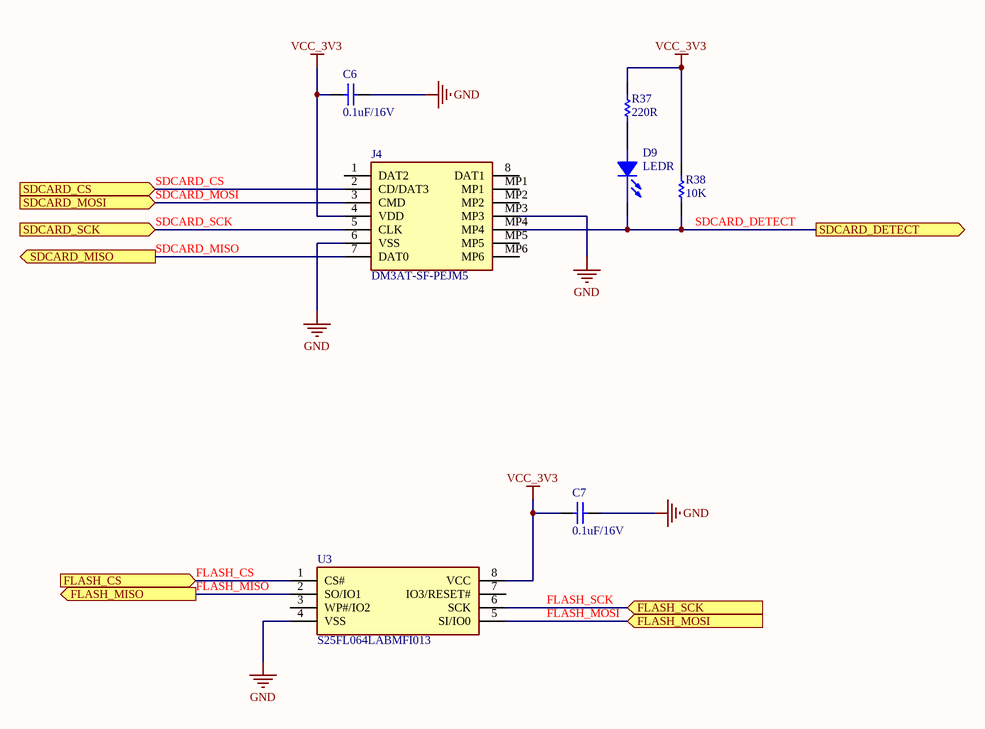
[diagram p5: SDCARD_FLASH.SchDoc]

### Parts
C6  0.1uF/16V  [0603C]
C7  0.1uF/16V  [0603C]
D9  LEDR  [LED_0603]
J4  DM3AT-SF-PEJM5  [DM3ATSFPEJM5]
R37  220R  [0603R]
R38  10K  [0603R]
U3  S25FL064LABMFI013  [S25FL064LABMFI013]

### Ports
FLASH_CS (in), FLASH_MISO (out), FLASH_MOSI (in), FLASH_SCK (in), SDCARD_CS (in), SDCARD_DETECT (out), SDCARD_MISO (out), SDCARD_MOSI (in), SDCARD_SCK (in)

### Nets
GND: C6.1 C7.1 J4.6(VSS) J4.MP3 U3.4(VSS)
VCC_3V3: C6.2 C7.2 J4.4(VDD) R37.2 R38.1 U3.8(VCC)
FLASH_CS: U3.1(CS#) ; port FLASH_CS
FLASH_MISO: J4.7(DAT0) U3.2(SO/IO1) ; port SDCARD_MISO, port FLASH_MISO  [also labelled SDCARD_MISO]
FLASH_MOSI: J4.3(CMD) U3.5(SI/IO0) ; port SDCARD_MOSI, port FLASH_MOSI  [also labelled SDCARD_MOSI]
FLASH_SCK: J4.5(CLK) U3.6(SCK) ; port SDCARD_SCK, port FLASH_SCK  [also labelled SDCARD_SCK]
SDCARD_CS: J4.2(CD/DAT3) ; port SDCARD_CS
SDCARD_DETECT: D9.2(CATHODE) J4.MP4 R38.2 ; port SDCARD_DETECT
NetD9_1: D9.1(ANODE) R37.1

Not connected (* = marked no-connect by the designer): J4 1(DAT2) 8(DAT1) MP1 MP2 MP5 MP6; U3 3(WP#/IO2) 7(IO3/RESET#)

### Library data of the parts
C6 C7 = Cap: as C1 on sheet RTC; Value: 0.1uF/16V; Package: 0603; Price: 0.101; Stockiest: MOUSER; Stockiest Part No: 963-EMK107B7104KAHT
D9 = LED: as D5 on sheet STM32; Package: 0603; Price: 0.28; Stockiest: MOUSER; Stockiest Part No: 859-LTSTC193KRKT5A; Value: RED
J4 = DM3AT-SF-PEJM5: Memory Card Connectors R/A SMT MICROSD CON PUSH-PUSH TOP BRDMNT; Mfr: Hirose Connector; Mfr Part No: DM3AT-SF-PEJM5; Price: 2.52; Stockiest: MOUSER; Stockiest Part No: 798-DM3AT-SF-PEJM5
R37 = Res1: as R30 on sheet FTDI; Package: 0603; Price: 0.101; Stockiest: MOUSER; Stockiest Part No: 71-CRCW0603220RJNEAC; Value: 220R
R38 = Res1: as R1 on sheet RTC; Value: 10K; Package: 0603; Price: 0.101; Stockiest: MOUSER; Stockiest Part No: 755-SFR03EZPF1002
U3 = S25FL064LABMFI013: NOR Flash Nor; Mfr: Cypress Semiconductor; Value: 64Mbit; Mfr Part No: S25FL064LABMFI013; Price: 1.45; Stockiest: MOUSER; Stockiest Part No: 727-S25FL064LAMFI013

## Sheet LCD.SchDoc
size B
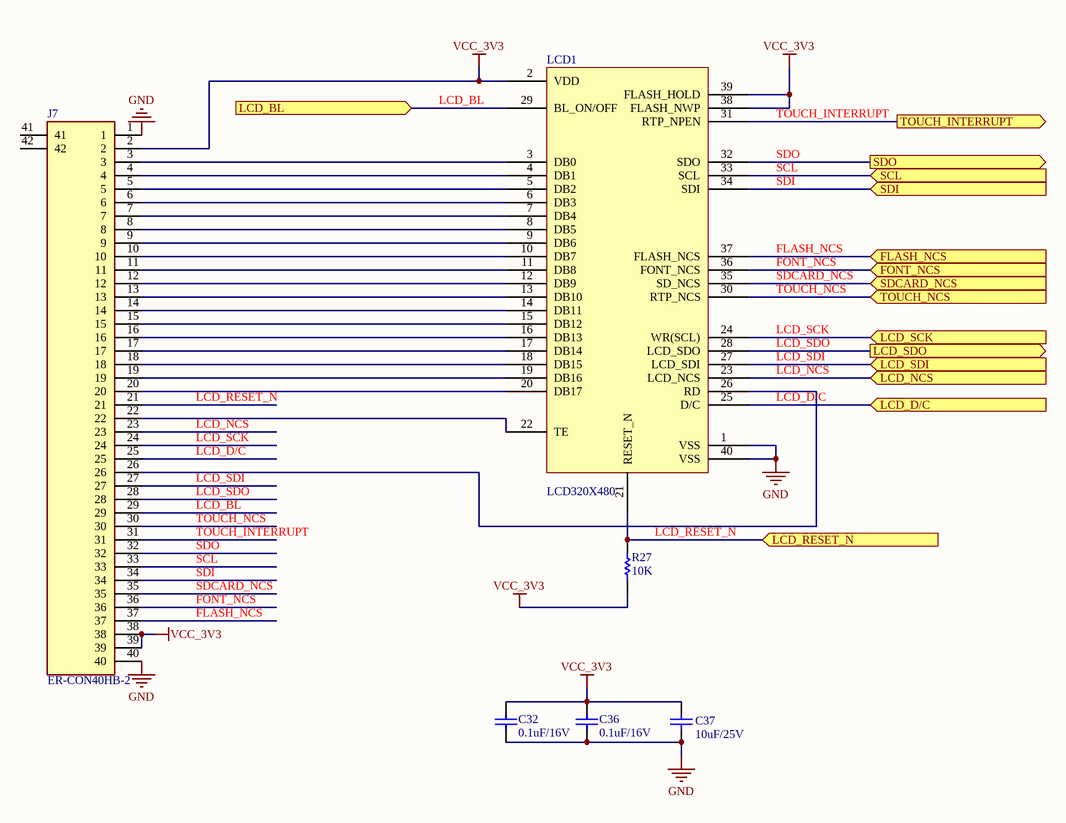
[diagram p6: LCD.SchDoc]

### Parts
C32  0.1uF/16V  [0603C]
C36  0.1uF/16V  [0603C]
C37  10uF/25V  [0805C]
J7  ER-CON40HB-2  [ERCON40HB2]
LCD1  LCD320X480  [HDR2X20]
R27  10K  [0603R]

### Ports
FLASH_NCS (in), FONT_NCS (in), LCD_BL (in), LCD_D/C (in), LCD_NCS (in), LCD_RESET_N (in), LCD_SCK (in), LCD_SDI (in), LCD_SDO (out), SCL (in), SDCARD_NCS (in), SDI (in), SDO (out), TOUCH_INTERRUPT (out), TOUCH_NCS (in)

### Nets
GND: C32.2 C36.2 C37.1 J7.1 J7.40 LCD1.1(VSS) LCD1.40(VSS)
VCC_3V3: C32.1 C36.1 C37.2 J7.2 J7.38 J7.39 LCD1.2(VDD) LCD1.38(FLASH_NWP) LCD1.39(FLASH_HOLD) R27.2
FLASH_NCS: J7.37 LCD1.37(FLASH_NCS) ; port FLASH_NCS
FONT_NCS: J7.36 LCD1.36(FONT_NCS) ; port FONT_NCS
LCD_BL: J7.29 LCD1.29(BL_ON/OFF) ; port LCD_BL
LCD_D/C: J7.25 LCD1.25(D/C) ; port LCD_D/C
LCD_NCS: J7.23 LCD1.23(LCD_NCS) ; port LCD_NCS
LCD_RESET_N: J7.21 LCD1.21(RESET_N) R27.1 ; port LCD_RESET_N
LCD_SCK: J7.24 LCD1.24(WR(SCL)) ; port LCD_SCK
LCD_SDI: J7.27 LCD1.27(LCD_SDI) ; port LCD_SDI
LCD_SDO: J7.28 LCD1.28(LCD_SDO) ; port LCD_SDO
SCL: J7.33 LCD1.33(SCL) ; port SCL  [project net FLASH_SCK]
SDCARD_NCS: J7.35 LCD1.35(SD_NCS) ; port SDCARD_NCS  [project net LCD_SDCARD_CS]
SDI: J7.34 LCD1.34(SDI) ; port SDI  [project net FLASH_MOSI]
SDO: J7.32 LCD1.32(SDO) ; port SDO  [project net FLASH_MISO]
TOUCH_INTERRUPT: J7.31 LCD1.31(RTP_NPEN) ; port TOUCH_INTERRUPT  [project net LCD_TOUCH_INTR]
TOUCH_NCS: J7.30 LCD1.30(RTP_NCS) ; port TOUCH_NCS  [project net LCD_TOUCH_CS]
NetJ7_3: J7.3 LCD1.3(DB0)
NetJ7_4: J7.4 LCD1.4(DB1)
NetJ7_5: J7.5 LCD1.5(DB2)
NetJ7_6: J7.6 LCD1.6(DB3)
NetJ7_7: J7.7 LCD1.7(DB4)
NetJ7_8: J7.8 LCD1.8(DB5)
NetJ7_9: J7.9 LCD1.9(DB6)
NetJ7_10: J7.10 LCD1.10(DB7)
NetJ7_11: J7.11 LCD1.11(DB8)
NetJ7_12: J7.12 LCD1.12(DB9)
NetJ7_13: J7.13 LCD1.13(DB10)
NetJ7_14: J7.14 LCD1.14(DB11)
NetJ7_15: J7.15 LCD1.15(DB12)
NetJ7_16: J7.16 LCD1.16(DB13)
NetJ7_17: J7.17 LCD1.17(DB14)
NetJ7_18: J7.18 LCD1.18(DB15)
NetJ7_19: J7.19 LCD1.19(DB16)
NetJ7_20: J7.20 LCD1.20(DB17)
NetJ7_22: J7.22 LCD1.22(TE)
NetJ7_26: J7.26 LCD1.26(RD)

Not connected (* = marked no-connect by the designer): J7 41 42

### Library data of the parts
C32 C36 = Cap: as C1 on sheet RTC; Package: 0603; Price: 0.101; Stockiest: MOUSER; Stockiest Part No: 963-EMK107B7104KAHT; Value: 0.1uF/16V
C37 = Cap: as C10 on sheet STM32; Package: 0805; Price: 0.232; Stockiest: MOUSER; Stockiest Part No: 963-TMK212BBJ106MG-T; Value: 10uF/25V
J7 = ER-CON40HB-2: 40 Pin 1.0mm Pitch Bottom Contact ZIF Connector,FPC Connector
LCD1 = ER-TFTM035-6: Mfr: Buy LCD; Mfr Part No: ER-TFTM035-6; Price: 17; Stockiest: BUY LCD; Stockiest Part No: ER-TFTM035-6; Value: 320x480
R27 = Res1: as R1 on sheet RTC; Package: 0603; Price: 0.101; Stockiest: MOUSER; Stockiest Part No: 755-SFR03EZPF1002; Value: 10K

## Sheet BOARD_CONNECTOR.SchDoc
size A3
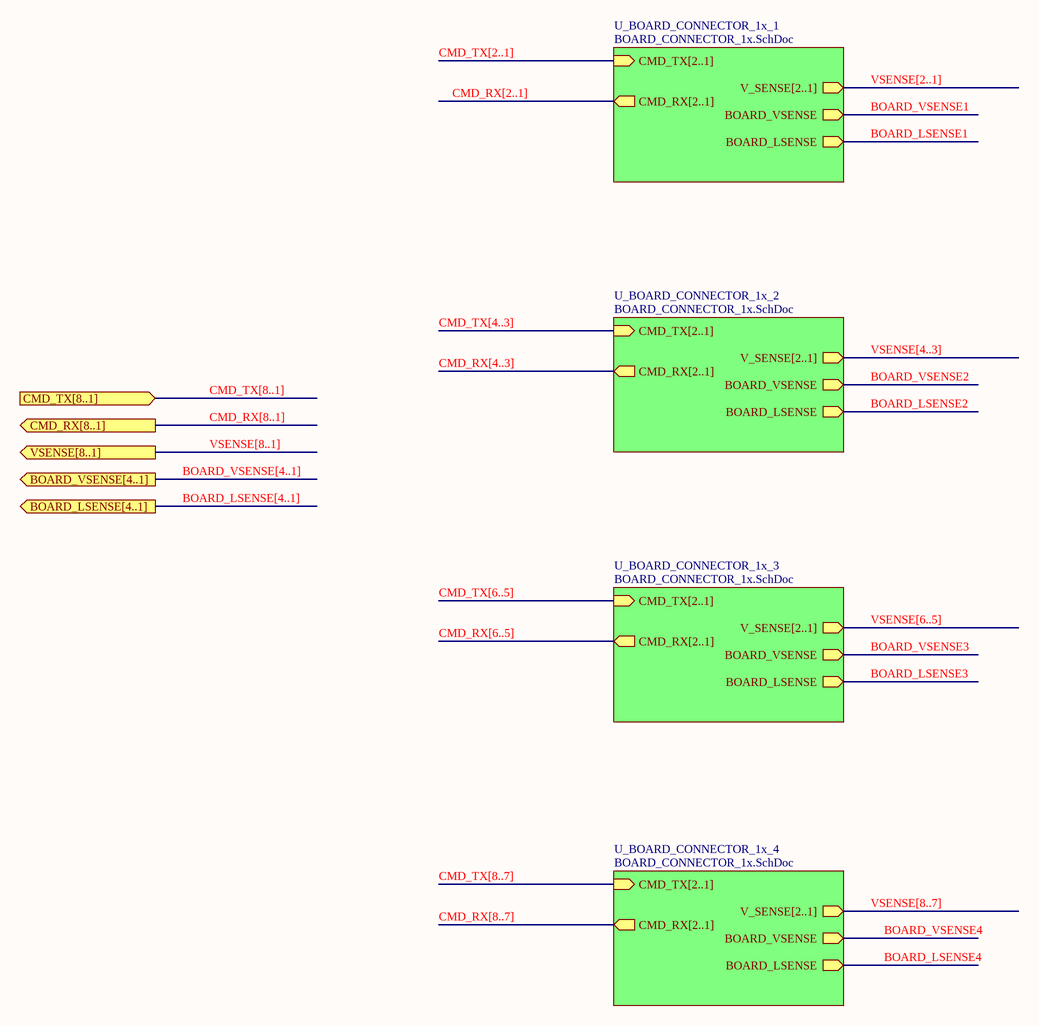
[diagram p7: BOARD_CONNECTOR.SchDoc]

### Sub-sheets
U_BOARD_CONNECTOR_1x_1 = BOARD_CONNECTOR_1x.SchDoc: CMD_TX[2..1] (in), CMD_RX[2..1] (out), BOARD_VSENSE (out), BOARD_LSENSE (out), V_SENSE[2..1] (out)
U_BOARD_CONNECTOR_1x_2 = BOARD_CONNECTOR_1x.SchDoc: CMD_TX[2..1] (in), CMD_RX[2..1] (out), BOARD_VSENSE (out), BOARD_LSENSE (out), V_SENSE[2..1] (out)
U_BOARD_CONNECTOR_1x_3 = BOARD_CONNECTOR_1x.SchDoc: CMD_TX[2..1] (in), CMD_RX[2..1] (out), BOARD_VSENSE (out), BOARD_LSENSE (out), V_SENSE[2..1] (out)
U_BOARD_CONNECTOR_1x_4 = BOARD_CONNECTOR_1x.SchDoc: CMD_TX[2..1] (in), CMD_RX[2..1] (out), BOARD_VSENSE (out), BOARD_LSENSE (out), V_SENSE[2..1] (out)

### Ports
BOARD_LSENSE[4..1] (out), BOARD_VSENSE[4..1] (out), CMD_RX[8..1] (out), CMD_TX[8..1] (in), VSENSE[8..1] (out)

### Buses and harness runs
bus BOARD_LSENSE[4..1] = port BOARD_LSENSE[4..1]
bus BOARD_VSENSE[4..1] = port BOARD_VSENSE[4..1]
bus CMD_RX[2..1] = sheet U_BOARD_CONNECTOR_1x_1/CMD_RX[2..1]
bus CMD_RX[4..3] = sheet U_BOARD_CONNECTOR_1x_2/CMD_RX[2..1]
bus CMD_RX[6..5] = sheet U_BOARD_CONNECTOR_1x_3/CMD_RX[2..1]
bus CMD_RX[8..1] = port CMD_RX[8..1]
bus CMD_RX[8..7] = sheet U_BOARD_CONNECTOR_1x_4/CMD_RX[2..1]
bus CMD_TX[2..1] = sheet U_BOARD_CONNECTOR_1x_1/CMD_TX[2..1]
bus CMD_TX[4..3] = sheet U_BOARD_CONNECTOR_1x_2/CMD_TX[2..1]
bus CMD_TX[6..5] = sheet U_BOARD_CONNECTOR_1x_3/CMD_TX[2..1]
bus CMD_TX[8..1] = port CMD_TX[8..1]
bus CMD_TX[8..7] = sheet U_BOARD_CONNECTOR_1x_4/CMD_TX[2..1]
bus VSENSE[2..1] = sheet U_BOARD_CONNECTOR_1x_1/V_SENSE[2..1]
bus VSENSE[4..3] = sheet U_BOARD_CONNECTOR_1x_2/V_SENSE[2..1]
bus VSENSE[6..5] = sheet U_BOARD_CONNECTOR_1x_3/V_SENSE[2..1]
bus VSENSE[8..1] = port VSENSE[8..1]
bus VSENSE[8..7] = sheet U_BOARD_CONNECTOR_1x_4/V_SENSE[2..1]

## Sheet BOARD_CONNECTOR_1x.SchDoc
size B
Used 4 times, as channels BOARD_CONNECTOR/U_BOARD_CONNECTOR_1x_1, BOARD_CONNECTOR/U_BOARD_CONNECTOR_1x_2, BOARD_CONNECTOR/U_BOARD_CONNECTOR_1x_3, BOARD_CONNECTOR/U_BOARD_CONNECTOR_1x_4. Parts and nets are listed once, with the designators drawn on the sheet.
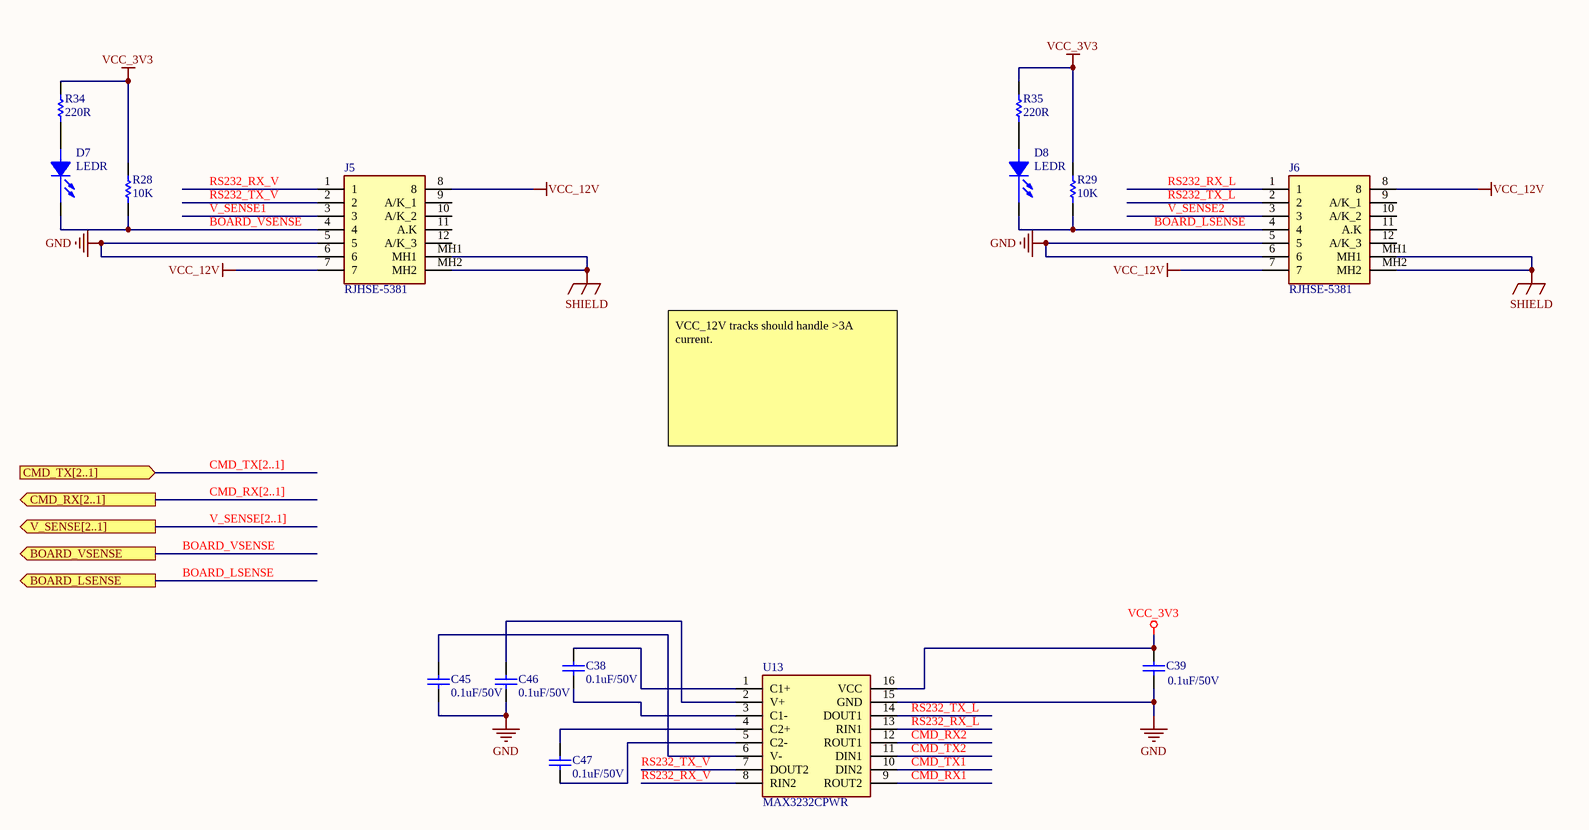
[diagram p8: BOARD_CONNECTOR_1x.SchDoc]

### Parts
C38  0.1uF/50V  [0603C]
C39  0.1uF/50V  [0603C]
C45  0.1uF/50V  [0603C]
C46  0.1uF/50V  [0603C]
C47  0.1uF/50V  [0603C]
D7  LEDR  [LED_0603]
D8  LEDR  [LED_0603]
J5  RJHSE-5381  [RJHSE5381]
J6  RJHSE-5381  [RJHSE5381]
R28  10K  [0603R]
R29  10K  [0603R]
R34  220R  [0603R]
R35  220R  [0603R]
U13  MAX3232CPWR  [MAX3232CPWR]

### Ports
BOARD_LSENSE (out), BOARD_VSENSE (out), CMD_RX[2..1] (out), CMD_TX[2..1] (in), V_SENSE[2..1] (out)

### Nets
GND: C39.1 C45.1 C46.1 J5.5 J5.6 J6.5 J6.6 U13.15(GND)
SHIELD: J5.MH1 J5.MH2 J6.MH1 J6.MH2
VCC_3V3: C39.2 R28.1 R29.1 R34.2 R35.2 U13.16(VCC)
VCC_12V: J5.7 J5.8 J6.7 J6.8
BOARD_LSENSE: D8.2(CATHODE) J6.4 R29.2 ; port BOARD_LSENSE
BOARD_VSENSE: D7.2(CATHODE) J5.4 R28.2 ; port BOARD_VSENSE
CMD_RX1: U13.9(ROUT2)
CMD_RX2: U13.12(ROUT1)
CMD_TX1: U13.10(DIN2)
CMD_TX2: U13.11(DIN1)
RS232_RX_L: J6.1 U13.13(RIN1)
RS232_RX_V: J5.1 U13.8(RIN2)
RS232_TX_L: J6.2 U13.14(DOUT1)
RS232_TX_V: J5.2 U13.7(DOUT2)
V_SENSE1: J5.3
V_SENSE2: J6.3
NetC38_1: C38.1 U13.3(C1-)
NetC38_2: C38.2 U13.1(C1+)
NetC45_2: C45.2 U13.6(V-)
NetC46_2: C46.2 U13.2(V+)
NetC47_1: C47.1 U13.5(C2-)
NetC47_2: C47.2 U13.4(C2+)
NetD7_1: D7.1(ANODE) R34.1
NetD8_1: D8.1(ANODE) R35.1

Not connected (* = marked no-connect by the designer): J5 9(A/K_1) 10(A/K_2) 11(A.K) 12(A/K_3); J6 9(A/K_1) 10(A/K_2) 11(A.K) 12(A/K_3)

### Channels
BOARD_CONNECTOR/U_BOARD_CONNECTOR_1x_1: designators end in _U_BOARD_CONNECTOR_1x_1; ports BOARD_LSENSE=BOARD_LSENSE BOARD_VSENSE=BOARD_SENSE1
BOARD_CONNECTOR/U_BOARD_CONNECTOR_1x_2: designators end in _U_BOARD_CONNECTOR_1x_2; ports BOARD_LSENSE=BOARD_LSENSE BOARD_VSENSE=BOARD_SENSE2
BOARD_CONNECTOR/U_BOARD_CONNECTOR_1x_3: designators end in _U_BOARD_CONNECTOR_1x_3; ports BOARD_LSENSE=BOARD_LSENSE BOARD_VSENSE=BOARD_SENSE3
BOARD_CONNECTOR/U_BOARD_CONNECTOR_1x_4: designators end in _U_BOARD_CONNECTOR_1x_4; ports BOARD_LSENSE=BOARD_LSENSE BOARD_VSENSE=BOARD_SENSE4

### Buses and harness runs
bus CMD_RX[2..1] = port CMD_RX[2..1]
bus CMD_TX[2..1] = port CMD_TX[2..1]
bus V_SENSE[2..1] = port V_SENSE[2..1]

### Notes on the sheet
- VCC_12V tracks should handle >3A current.

### Library data of the parts
C38 C39 C45-C47 = Cap: Multilayer Ceramic Capacitors MLCC - SMD/SMT 50V 0.1uF 0603 X7R 20%; Mfr: KEMET; Mfr Part No: C0603C104M5RACTU; Package: 0603; Price: 0.101; Stockiest: MOUSER; Stockiest Part No: 80-C0603C104M5R; Value: 0.1uF/50V
D7 D8 = LED: as D5 on sheet STM32; Package: 0603; Price: 0.28; Stockiest: MOUSER; Stockiest Part No: 859-LTSTC193KRKT5A; Value: RED
J5 J6 = RJHSE-5381: Modular Connectors / Ethernet Connectors R/A RJ45 SHEILDED 8 CONT Y/G LEDS; Mfr: Amphenol Commercial Products; Mfr Part No: RJHSE-5381; Price: 1.77; Stockiest: MOUSER; Stockiest Part No: 523-RJHSE-5381
R28 R29 = Res1: as R1 on sheet RTC; Value: 10K; Package: 0603; Price: 0.101; Stockiest: MOUSER; Stockiest Part No: 755-SFR03EZPF1002
R34 R35 = Res1: as R30 on sheet FTDI; Package: 0603; Price: 0.101; Stockiest: MOUSER; Stockiest Part No: 71-CRCW0603220RJNEAC; Value: 220R
U13 = MAX3232CPWR: RS-232 Interface IC 3-5.5V Mult-Ch RS232; Mfr: Texas Instruments; Mfr Part No: MAX3232CPWR; Price: 0.94; Stockiest: MOUSER; Stockiest Part No: 595-MAX3232CPWR

## Sheet POWER_CONTROLLER.SchDoc
size B
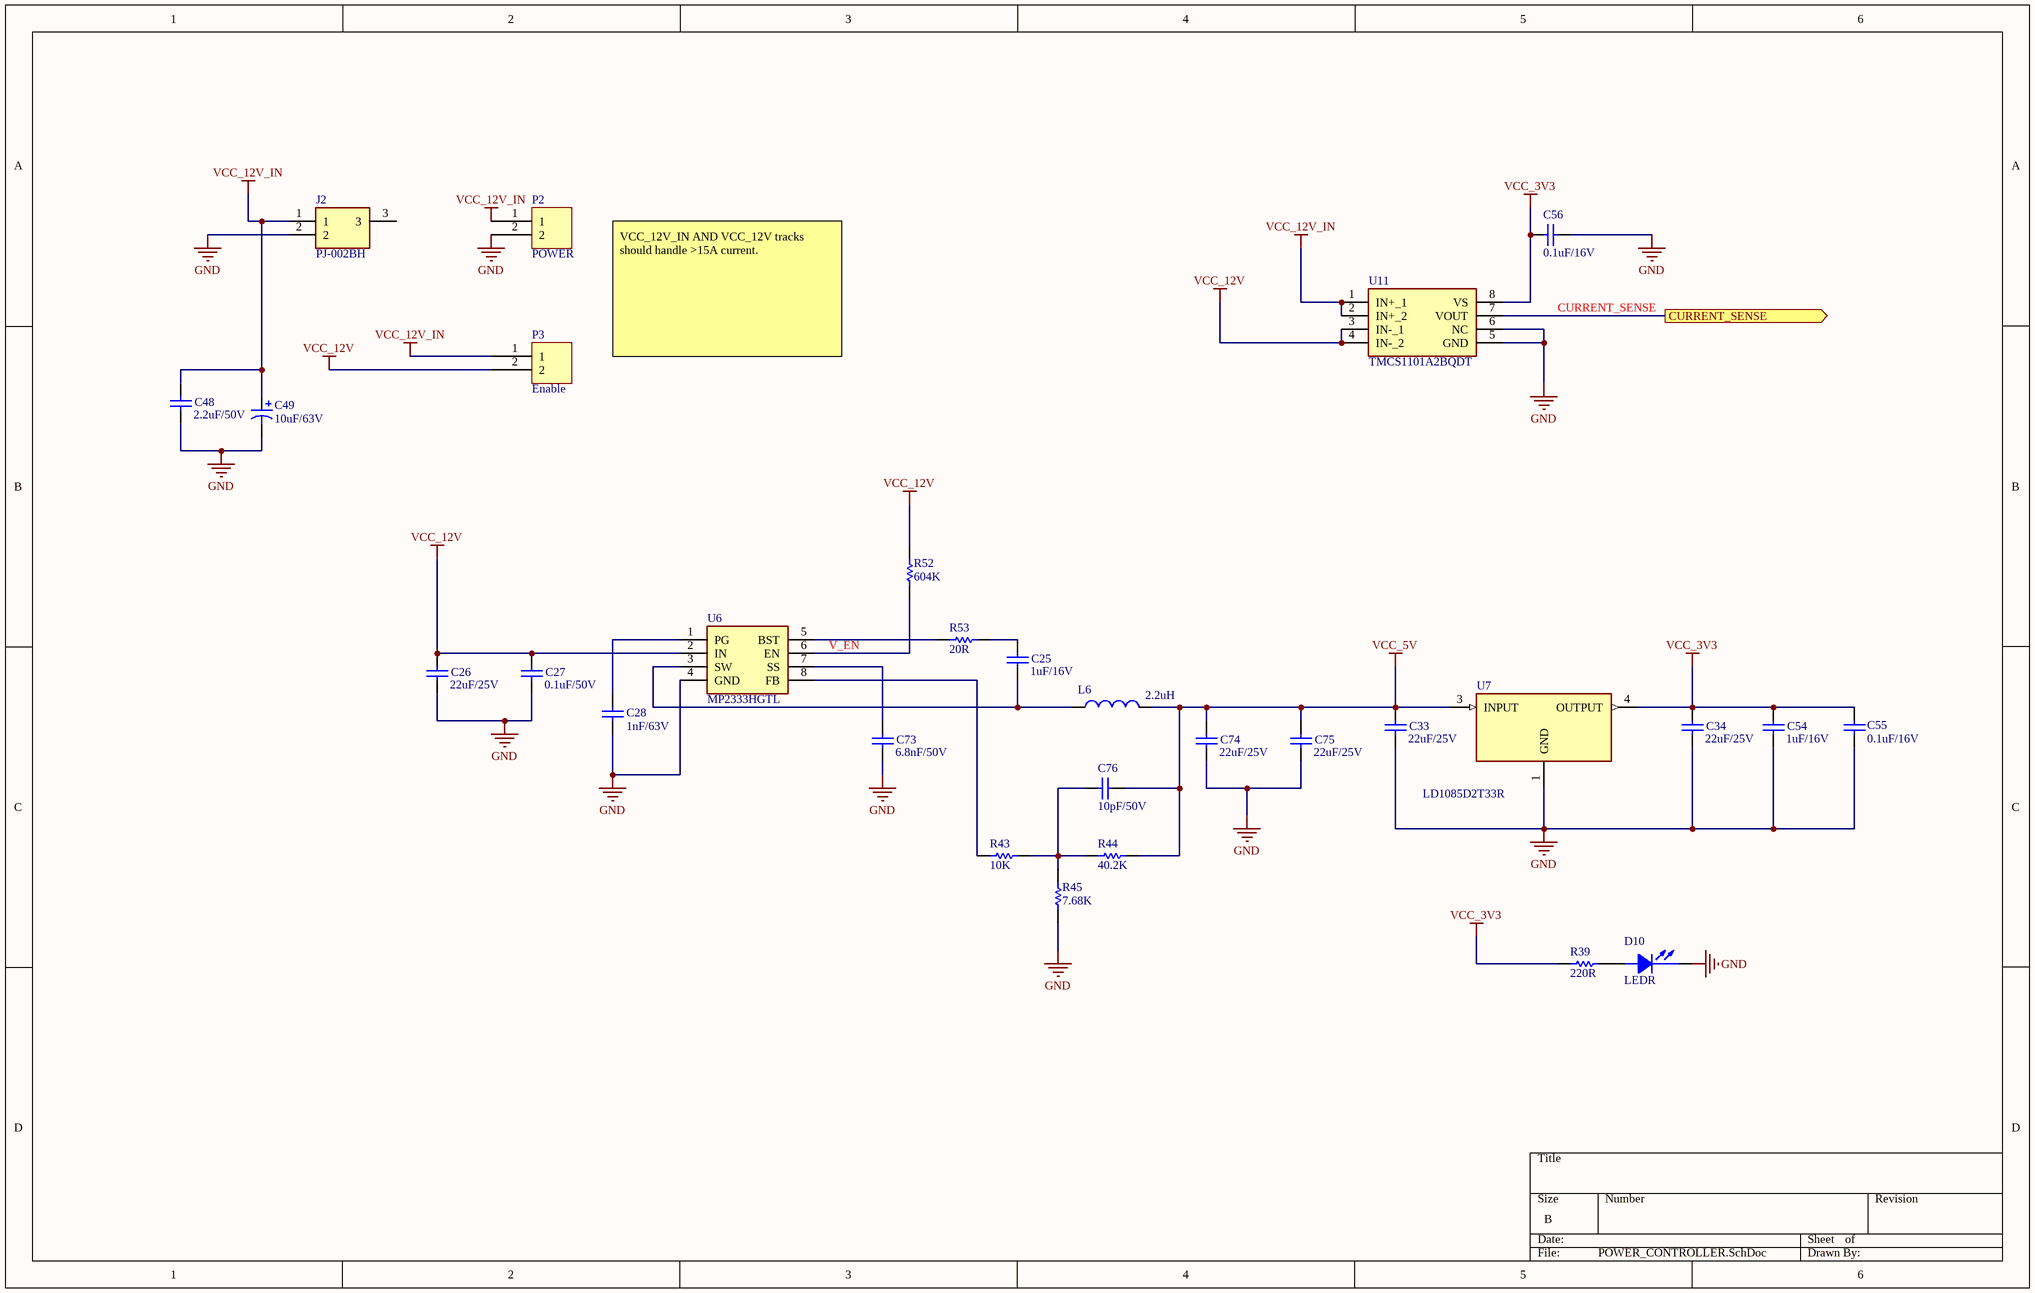
[diagram p9: POWER_CONTROLLER.SchDoc]

### Parts
(Parts that share a designator on the sheet are numbered #1, #2 ... from top to bottom, then left to right.)
C25  1uF/16V  [0603C]
C26  22uF/25V  [1210C]
C27  0.1uF/50V  [0603C]
C28  1nF/63V  [0603C]
C33  22uF/25V  [1210C]
C34  22uF/25V  [1210C]
C48  2.2uF/50V  [0603C]
C49  10uF/63V  [EEE-FN1J100L]
C54  1uF/16V  [0603C]
C55  0.1uF/16V  [0603C]
C56  0.1uF/16V  [0603C]
C73  6.8nF/50V  [0603C]
C74  22uF/25V  [1210C]
C75  22uF/25V  [1210C]
C76  10pF/50V  [0603C]
D10  LEDR  [LED_0603]
J2  PJ-002BH  [PJ002BH]
L6  2.2uH  [IHLP1616BZER2R2M5A]
P2  POWER  [HEADER_2]
P3  Enable  [HEADER_2]
R39  220R  [0603R]
R43  10K  [0603R]
R44  40.2K  [0603R]
R45  7.68K  [0603R]
R52  604K  [0603R]
R53  20R  [0603R]
U6  MP2333HGTL  [MP2333HGTL-P]
U7  LD1085D2T33R  [LD1085D2T33R]
U11#2  TMCS1101A2BQDT  [SOIC127P600X175-8N]

### Ports
CURRENT_SENSE (out)

### Nets
GND: C26.1 C27.1 C28.1 C33.1 C34.1 C48.1 C49.2 C54.1 C55.2 C56.2 C73.1 C74.1 C75.1 D10.2(CATHODE) J2.2 P2.2 R45.2 U6.4(GND) U7.1(GND) U11#2.5(GND) U11#2.6(NC)
VCC_3V3: C34.2 C54.2 C55.1 C56.1 R39.2 U7.4(OUTPUT) U11#2.8(VS)
VCC_5V: C33.2 C74.2 C75.2 C76.1 L6.2 R44.2 U7.3(INPUT)
VCC_12V: C26.2 C27.2 P3.2 R52.2 U6.2(IN) U11#2.3(IN-_1) U11#2.4(IN-_2)
VCC_12V_IN: C48.2 C49.1 J2.1 P2.1 P3.1 U11#2.1(IN+_1) U11#2.2(IN+_2)
CURRENT_SENSE: U11#2.7(VOUT) ; port CURRENT_SENSE
V_EN: R52.1 U6.6(EN)
NetC25_1: C25.1 L6.1 U6.3(SW)
NetC25_2: C25.2 R53.2
NetC28_2: C28.2 U6.1(PG)
NetC73_2: C73.2 U6.7(SS)
NetC76_2: C76.2 R43.1 R44.1 R45.1
NetD10_1: D10.1(ANODE) R39.1
NetR43_2: R43.2 U6.8(FB)
NetR53_1: R53.1 U6.5(BST)

Not connected (* = marked no-connect by the designer): J2 3

### Notes on the sheet
- VCC_12V_IN AND VCC_12V tracks should handle >15A current.

### Library data of the parts
C25 C54 = Cap: as C31 on sheet WIFI; Package: 0603; Price: 0.101; Stockiest: MOUSER; Stockiest Part No: 80-C0603C105K4RLR; Value: 1uF/16V
C26 C33 C34 C74 C75 = Cap: as C30 on sheet WIFI; Package: 1210; Price: 0.807; Stockiest: MOUSER; Stockiest Part No: 963-TMK325B7226MMHP; Value: 22uF/25V
C27 = Cap: as C38 on sheet BOARD_CONNECTOR_1x; Package: 0603; Price: 0.101; Stockiest: MOUSER; Stockiest Part No: 80-C0603C104M5R; Value: 0.1uF/50V
C28 = Cap: Multilayer Ceramic Capacitors MLCC - SMD/SMT 63V 1000pF 0603 X7R 10% AEC-Q200; Mfr: KEMET; Mfr Part No: 80-C0603C102KMREAUTO; Package: 0603; Price: 0.201; Stockiest: MOUSER; Stockiest Part No: C0603C102KMRECAUTO; Value: 1nF/63V
C48 = Cap: Multilayer Ceramic Capacitors MLCC - SMD/SMT 0603 2.2uF 20% 50VDC X5R; Mfr: Murata Electronics; Mfr Part No: GRM188R61H225ME11J; Package: 0603; Price: 0.333; Stockiest: MOUSER; Stockiest Part No: 81-GRM188R61H225ME1J; Value: 2.2uF/50V
C49 = Cap Pol1: Polarized Capacitor (Radial); Mfr: Panasonic; Value: 10uF/63V; Mfr Part No: EEE-FN1J100L; Package: SMD; Stockiest: MOUSER; Price: 0.484; Stockiest Part No: 667-EEE-FN1J100L
C55 C56 = Cap: as C1 on sheet RTC; Value: 0.1uF/16V; Package: 0603; Price: 0.101; Stockiest: MOUSER; Stockiest Part No: 963-EMK107B7104KAHT
C73 = Cap: Multilayer Ceramic Capacitors MLCC - SMD/SMT 0603 50VDC 6.8nF 5% C0G AEC-Q200; Mfr: TDK; Mfr Part No: CGA3E2C0G1H682J080AE; Package: 0603; Price: 0.363; Stockiest: MOUSER; Stockiest Part No: 810-CGA3E2C0G1H682J8; Value: 6.8nF/50V
C76 = Cap: as C4 on sheet RTC; Package: 0603; Price: 0.192; Stockiest: MOUSER; Stockiest Part No: 80-C0603C100J5GAUTO; Value: 10pF/50V
D10 = LED: as D5 on sheet STM32; Package: 0603; Price: 0.28; Stockiest: MOUSER; Stockiest Part No: 859-LTSTC193KRKT5A; Value: RED
J2 = PJ-002BH: Connector; Mfr Part No: PJ-002BH
L6 = INDUCTOR: Fixed Inductors 2.2uH 20% High Temp AEC-Q200; Mfr: Vishay / Dale; Mfr Part No: IHLP1616BZER2R2M5A; Price: 1.36; Stockiest: MOUSER; Stockiest Part No: 70-IHLP1616BZR2R2M5A; Value: 2.2uH
P2 P3 = HEADER_2
R39 = Res1: as R30 on sheet FTDI; Package: 0603; Price: 0.101; Stockiest: MOUSER; Stockiest Part No: 71-CRCW0603220RJNEAC; Value: 220R
R43 = Res1: as R1 on sheet RTC; Package: 0603; Price: 0.101; Stockiest: MOUSER; Stockiest Part No: 755-SFR03EZPF1002; Value: 10K
R44 = Res1: Thick Film Resistors - SMD 0603 Anti-Surge Res. 0.1%, 40.2Koh; Mfr: Panasonic; Mfr Part No: ERJ-PB3B4022V; Package: 0603; Price: 0.252; Stockiest: MOUSER; Stockiest Part No: 667-ERJ-PB3B4022V; Value: 40.2K
R45 = Res1: Thick Film Resistors - SMD 0603 Anti-Surge Res. 0.1%, 7.68Koh; Mfr: Panasonic; Mfr Part No: ERJ-PB3B7681V; Package: 0603; Price: 0.252; Stockiest: MOUSER; Stockiest Part No: 667-ERJ-PB3B7681V; Value: 7.68K
R52 = Res1: Thick Film Resistors - SMD 0603 1% 604Kohm Anti-Sulfur AEC-Q200; Mfr: Panasonic; Mfr Part No: ERJ-U03F6043V; Package: 0603; Price: 0.221; Stockiest: MOUSER; Stockiest Part No: 667-ERJ-U03F6043V; Value: 604K
R53 = Res1: Thick Film Resistors - SMD 0603 0.25W 1% 20ohm AEC-Q200; Mfr: Panasonic; Mfr Part No: ERJ-UP3F20R0V; Package: 0603; Price: 0.262; Stockiest: MOUSER; Stockiest Part No: 667-ERJ-UP3F20R0V; Value: 20R
U6 = MP2333HGTL: Switching Voltage Regulators High-Efficiency, 3A, 18V, 1200kHz, Synchronous, Step-Down Converter; Mfr: Monolithic Power Systems (MPS); Value: 3.3V; Mfr Part No: MP2333HGTL-P; Price: 1.89; Stockiest: MOUSER; Stockiest Part No: 946-MP2333HGTL-P
U7 = LD1085D2T33R: Integrated Circuit; Mfr: STMicroelectronics; Value: 3.3V; Mfr Part No: LD1085D2T33R; Price: 1.30; Stockiest: MOUSER; Stockiest Part No: 511-LD1085D2T33-TR
U11#2 = TMCS1101A1BQDR: Board Mount Current Sensors Precision isolated current sensor with internal reference 8-SOIC -40 to 125; Mfr: Texas Instruments; Mfr Part No: TMCS1101A2BQDT; Price: 5.22; Stockiest: MOUSER; Stockiest Part No: 595-TMCS1101A2BQDT

## Nets that join several sheets
GND: RTC (7 pins), FTDI (16 pins), WIFI (17 pins), STM32 (38 pins), SDCARD_FLASH (5 pins), LCD (7 pins), BOARD_CONNECTOR/U_BOARD_CONNECTOR_1x_1 (8 pins), BOARD_CONNECTOR/U_BOARD_CONNECTOR_1x_2 (8 pins), BOARD_CONNECTOR/U_BOARD_CONNECTOR_1x_3 (8 pins), BOARD_CONNECTOR/U_BOARD_CONNECTOR_1x_4 (8 pins), POWER_CONTROLLER (21 pins)
SHIELD: FTDI (6 pins), BOARD_CONNECTOR/U_BOARD_CONNECTOR_1x_1 (J5_U_BOARD_CONNECTOR_1x_1.MH1 J5_U_BOARD_CONNECTOR_1x_1.MH2 J6_U_BOARD_CONNECTOR_1x_1.MH1 J6_U_BOARD_CONNECTOR_1x_1.MH2), BOARD_CONNECTOR/U_BOARD_CONNECTOR_1x_2 (J5_U_BOARD_CONNECTOR_1x_2.MH1 J5_U_BOARD_CONNECTOR_1x_2.MH2 J6_U_BOARD_CONNECTOR_1x_2.MH1 J6_U_BOARD_CONNECTOR_1x_2.MH2), BOARD_CONNECTOR/U_BOARD_CONNECTOR_1x_3 (J5_U_BOARD_CONNECTOR_1x_3.MH1 J5_U_BOARD_CONNECTOR_1x_3.MH2 J6_U_BOARD_CONNECTOR_1x_3.MH1 J6_U_BOARD_CONNECTOR_1x_3.MH2), BOARD_CONNECTOR/U_BOARD_CONNECTOR_1x_4 (J5_U_BOARD_CONNECTOR_1x_4.MH1 J5_U_BOARD_CONNECTOR_1x_4.MH2 J6_U_BOARD_CONNECTOR_1x_4.MH1 J6_U_BOARD_CONNECTOR_1x_4.MH2)
VBAT: RTC (C2.1 C3.1 J3.2 U1.3), STM32 (U5.1)
VCC_3V3: RTC (5 pins), FTDI (L2.1), WIFI (7 pins), STM32 (31 pins), SDCARD_FLASH (6 pins), LCD (10 pins), BOARD_CONNECTOR/U_BOARD_CONNECTOR_1x_1 (6 pins), BOARD_CONNECTOR/U_BOARD_CONNECTOR_1x_2 (6 pins), BOARD_CONNECTOR/U_BOARD_CONNECTOR_1x_3 (6 pins), BOARD_CONNECTOR/U_BOARD_CONNECTOR_1x_4 (6 pins), POWER_CONTROLLER (7 pins)
VCC_12V: BOARD_CONNECTOR/U_BOARD_CONNECTOR_1x_1 (J5_U_BOARD_CONNECTOR_1x_1.7 J5_U_BOARD_CONNECTOR_1x_1.8 J6_U_BOARD_CONNECTOR_1x_1.7 J6_U_BOARD_CONNECTOR_1x_1.8), BOARD_CONNECTOR/U_BOARD_CONNECTOR_1x_2 (J5_U_BOARD_CONNECTOR_1x_2.7 J5_U_BOARD_CONNECTOR_1x_2.8 J6_U_BOARD_CONNECTOR_1x_2.7 J6_U_BOARD_CONNECTOR_1x_2.8), BOARD_CONNECTOR/U_BOARD_CONNECTOR_1x_3 (J5_U_BOARD_CONNECTOR_1x_3.7 J5_U_BOARD_CONNECTOR_1x_3.8 J6_U_BOARD_CONNECTOR_1x_3.7 J6_U_BOARD_CONNECTOR_1x_3.8), BOARD_CONNECTOR/U_BOARD_CONNECTOR_1x_4 (J5_U_BOARD_CONNECTOR_1x_4.7 J5_U_BOARD_CONNECTOR_1x_4.8 J6_U_BOARD_CONNECTOR_1x_4.7 J6_U_BOARD_CONNECTOR_1x_4.8), POWER_CONTROLLER (7 pins)
BOARD_LSENSE: STM32 (U10.12), BOARD_CONNECTOR/U_BOARD_CONNECTOR_1x_1 (D8_U_BOARD_CONNECTOR_1x_1.2 J6_U_BOARD_CONNECTOR_1x_1.4 R29_U_BOARD_CONNECTOR_1x_1.2)
BOARD_LSENSE: STM32 (U10.11), BOARD_CONNECTOR/U_BOARD_CONNECTOR_1x_2 (D8_U_BOARD_CONNECTOR_1x_2.2 J6_U_BOARD_CONNECTOR_1x_2.4 R29_U_BOARD_CONNECTOR_1x_2.2)
BOARD_LSENSE: STM32 (U10.10), BOARD_CONNECTOR/U_BOARD_CONNECTOR_1x_3 (D8_U_BOARD_CONNECTOR_1x_3.2 J6_U_BOARD_CONNECTOR_1x_3.4 R29_U_BOARD_CONNECTOR_1x_3.2)
BOARD_LSENSE: STM32 (U10.9), BOARD_CONNECTOR/U_BOARD_CONNECTOR_1x_4 (D8_U_BOARD_CONNECTOR_1x_4.2 J6_U_BOARD_CONNECTOR_1x_4.4 R29_U_BOARD_CONNECTOR_1x_4.2)
BOARD_SENSE1: STM32 (U10.4), BOARD_CONNECTOR/U_BOARD_CONNECTOR_1x_1 (D7_U_BOARD_CONNECTOR_1x_1.2 J5_U_BOARD_CONNECTOR_1x_1.4 R28_U_BOARD_CONNECTOR_1x_1.2)
BOARD_SENSE2: STM32 (U10.5), BOARD_CONNECTOR/U_BOARD_CONNECTOR_1x_2 (D7_U_BOARD_CONNECTOR_1x_2.2 J5_U_BOARD_CONNECTOR_1x_2.4 R28_U_BOARD_CONNECTOR_1x_2.2)
BOARD_SENSE3: STM32 (U10.6), BOARD_CONNECTOR/U_BOARD_CONNECTOR_1x_3 (D7_U_BOARD_CONNECTOR_1x_3.2 J5_U_BOARD_CONNECTOR_1x_3.4 R28_U_BOARD_CONNECTOR_1x_3.2)
BOARD_SENSE4: STM32 (U10.7), BOARD_CONNECTOR/U_BOARD_CONNECTOR_1x_4 (D7_U_BOARD_CONNECTOR_1x_4.2 J5_U_BOARD_CONNECTOR_1x_4.4 R28_U_BOARD_CONNECTOR_1x_4.2)
BOOT0: WIFI (U12.36), STM32 (R8.1 U5.60)
BOOT1: WIFI (U12.30), STM32 (R7.1 U5.28)
CMD_RX1: STM32 (U8.4), BOARD_CONNECTOR/U_BOARD_CONNECTOR_1x_1 (U13_U_BOARD_CONNECTOR_1x_1.9)
CMD_RX1: STM32 (U8.6), BOARD_CONNECTOR/U_BOARD_CONNECTOR_1x_2 (U13_U_BOARD_CONNECTOR_1x_2.9)
CMD_RX1: STM32 (U8.12), BOARD_CONNECTOR/U_BOARD_CONNECTOR_1x_3 (U13_U_BOARD_CONNECTOR_1x_3.9)
CMD_RX1: STM32 (U8.10), BOARD_CONNECTOR/U_BOARD_CONNECTOR_1x_4 (U13_U_BOARD_CONNECTOR_1x_4.9)
CMD_RX2: STM32 (U8.5), BOARD_CONNECTOR/U_BOARD_CONNECTOR_1x_1 (U13_U_BOARD_CONNECTOR_1x_1.12)
CMD_RX2: STM32 (U8.7), BOARD_CONNECTOR/U_BOARD_CONNECTOR_1x_2 (U13_U_BOARD_CONNECTOR_1x_2.12)
CMD_RX2: STM32 (U8.11), BOARD_CONNECTOR/U_BOARD_CONNECTOR_1x_3 (U13_U_BOARD_CONNECTOR_1x_3.12)
CMD_RX2: STM32 (U8.9), BOARD_CONNECTOR/U_BOARD_CONNECTOR_1x_4 (U13_U_BOARD_CONNECTOR_1x_4.12)
CMD_TX1: STM32 (U9.4), BOARD_CONNECTOR/U_BOARD_CONNECTOR_1x_1 (U13_U_BOARD_CONNECTOR_1x_1.10)
CMD_TX1: STM32 (U9.6), BOARD_CONNECTOR/U_BOARD_CONNECTOR_1x_2 (U13_U_BOARD_CONNECTOR_1x_2.10)
CMD_TX1: STM32 (U9.12), BOARD_CONNECTOR/U_BOARD_CONNECTOR_1x_3 (U13_U_BOARD_CONNECTOR_1x_3.10)
CMD_TX1: STM32 (U9.10), BOARD_CONNECTOR/U_BOARD_CONNECTOR_1x_4 (U13_U_BOARD_CONNECTOR_1x_4.10)
CMD_TX2: STM32 (U9.5), BOARD_CONNECTOR/U_BOARD_CONNECTOR_1x_1 (U13_U_BOARD_CONNECTOR_1x_1.11)
CMD_TX2: STM32 (U9.7), BOARD_CONNECTOR/U_BOARD_CONNECTOR_1x_2 (U13_U_BOARD_CONNECTOR_1x_2.11)
CMD_TX2: STM32 (U9.11), BOARD_CONNECTOR/U_BOARD_CONNECTOR_1x_3 (U13_U_BOARD_CONNECTOR_1x_3.11)
CMD_TX2: STM32 (U9.9), BOARD_CONNECTOR/U_BOARD_CONNECTOR_1x_4 (U13_U_BOARD_CONNECTOR_1x_4.11)
CURRENT_SENSE: STM32 (U5.14), POWER_CONTROLLER (U11#2.7)
FLASH_CS: STM32 (U5.9), SDCARD_FLASH (U3.1)
FLASH_MISO: STM32 (U5.35), SDCARD_FLASH (J4.7 U3.2), LCD (J7.32 LCD1.32)
FLASH_MOSI: STM32 (U5.36), SDCARD_FLASH (J4.3 U3.5), LCD (J7.34 LCD1.34)
FLASH_NCS: STM32 (U5.54), LCD (J7.37 LCD1.37)
FLASH_SCK: STM32 (U5.34), SDCARD_FLASH (J4.5 U3.6), LCD (J7.33 LCD1.33)
FONT_NCS: STM32 (U5.53), LCD (J7.36 LCD1.36)
I2C2_SCL: RTC (R3.1 U1.6), STM32 (U5.29)
I2C2_SDA: RTC (R2.1 U1.5), STM32 (U5.30)
LCD_BL: STM32 (U5.27), LCD (J7.29 LCD1.29)
LCD_D/C: STM32 (U5.59), LCD (J7.25 LCD1.25)
LCD_NCS: STM32 (U5.20), LCD (J7.23 LCD1.23)
LCD_RESET_N: STM32 (U5.26), LCD (J7.21 LCD1.21 R27.1)
LCD_SCK: STM32 (U5.21), LCD (J7.24 LCD1.24)
LCD_SDCARD_CS: STM32 (U5.44), LCD (J7.35 LCD1.35)
LCD_SDI: STM32 (U5.23), LCD (J7.27 LCD1.27)
LCD_SDO: STM32 (U5.22), LCD (J7.28 LCD1.28)
LCD_TOUCH_CS: STM32 (U5.57), LCD (J7.30 LCD1.30)
LCD_TOUCH_INTR: STM32 (U5.58), LCD (J7.31 LCD1.31)
MFP: RTC (R1.1 U1.7), STM32 (U5.62)
RXD: FTDI (R15.2 U2.4), STM32 (U5.51)
SDCARD_CS: STM32 (U5.10), SDCARD_FLASH (J4.2)
SDCARD_DETECT: STM32 (U5.17), SDCARD_FLASH (D9.2 J4.MP4 R38.2)
STM_nRST: WIFI (U12.37), STM32 (D2.2)
TXD: FTDI (R16.2 U2.1), STM32 (U5.52)
UART1_RX: WIFI (U12.35), STM32 (U5.43)
UART1_TX: WIFI (U12.34), STM32 (U5.42)
V_SENSE1: STM32 (U4.4), BOARD_CONNECTOR/U_BOARD_CONNECTOR_1x_1 (J5_U_BOARD_CONNECTOR_1x_1.3)
V_SENSE1: STM32 (U4.6), BOARD_CONNECTOR/U_BOARD_CONNECTOR_1x_2 (J5_U_BOARD_CONNECTOR_1x_2.3)
V_SENSE1: STM32 (U4.12), BOARD_CONNECTOR/U_BOARD_CONNECTOR_1x_3 (J5_U_BOARD_CONNECTOR_1x_3.3)
V_SENSE1: STM32 (U4.10), BOARD_CONNECTOR/U_BOARD_CONNECTOR_1x_4 (J5_U_BOARD_CONNECTOR_1x_4.3)
V_SENSE2: STM32 (U4.5), BOARD_CONNECTOR/U_BOARD_CONNECTOR_1x_1 (J6_U_BOARD_CONNECTOR_1x_1.3)
V_SENSE2: STM32 (U4.7), BOARD_CONNECTOR/U_BOARD_CONNECTOR_1x_2 (J6_U_BOARD_CONNECTOR_1x_2.3)
V_SENSE2: STM32 (U4.11), BOARD_CONNECTOR/U_BOARD_CONNECTOR_1x_3 (J6_U_BOARD_CONNECTOR_1x_3.3)
V_SENSE2: STM32 (U4.9), BOARD_CONNECTOR/U_BOARD_CONNECTOR_1x_4 (J6_U_BOARD_CONNECTOR_1x_4.3)